# EAGLE design ArmazEthernet- Rev A1 (EAGLE 7.5.0)

## Sheet 1 of 3
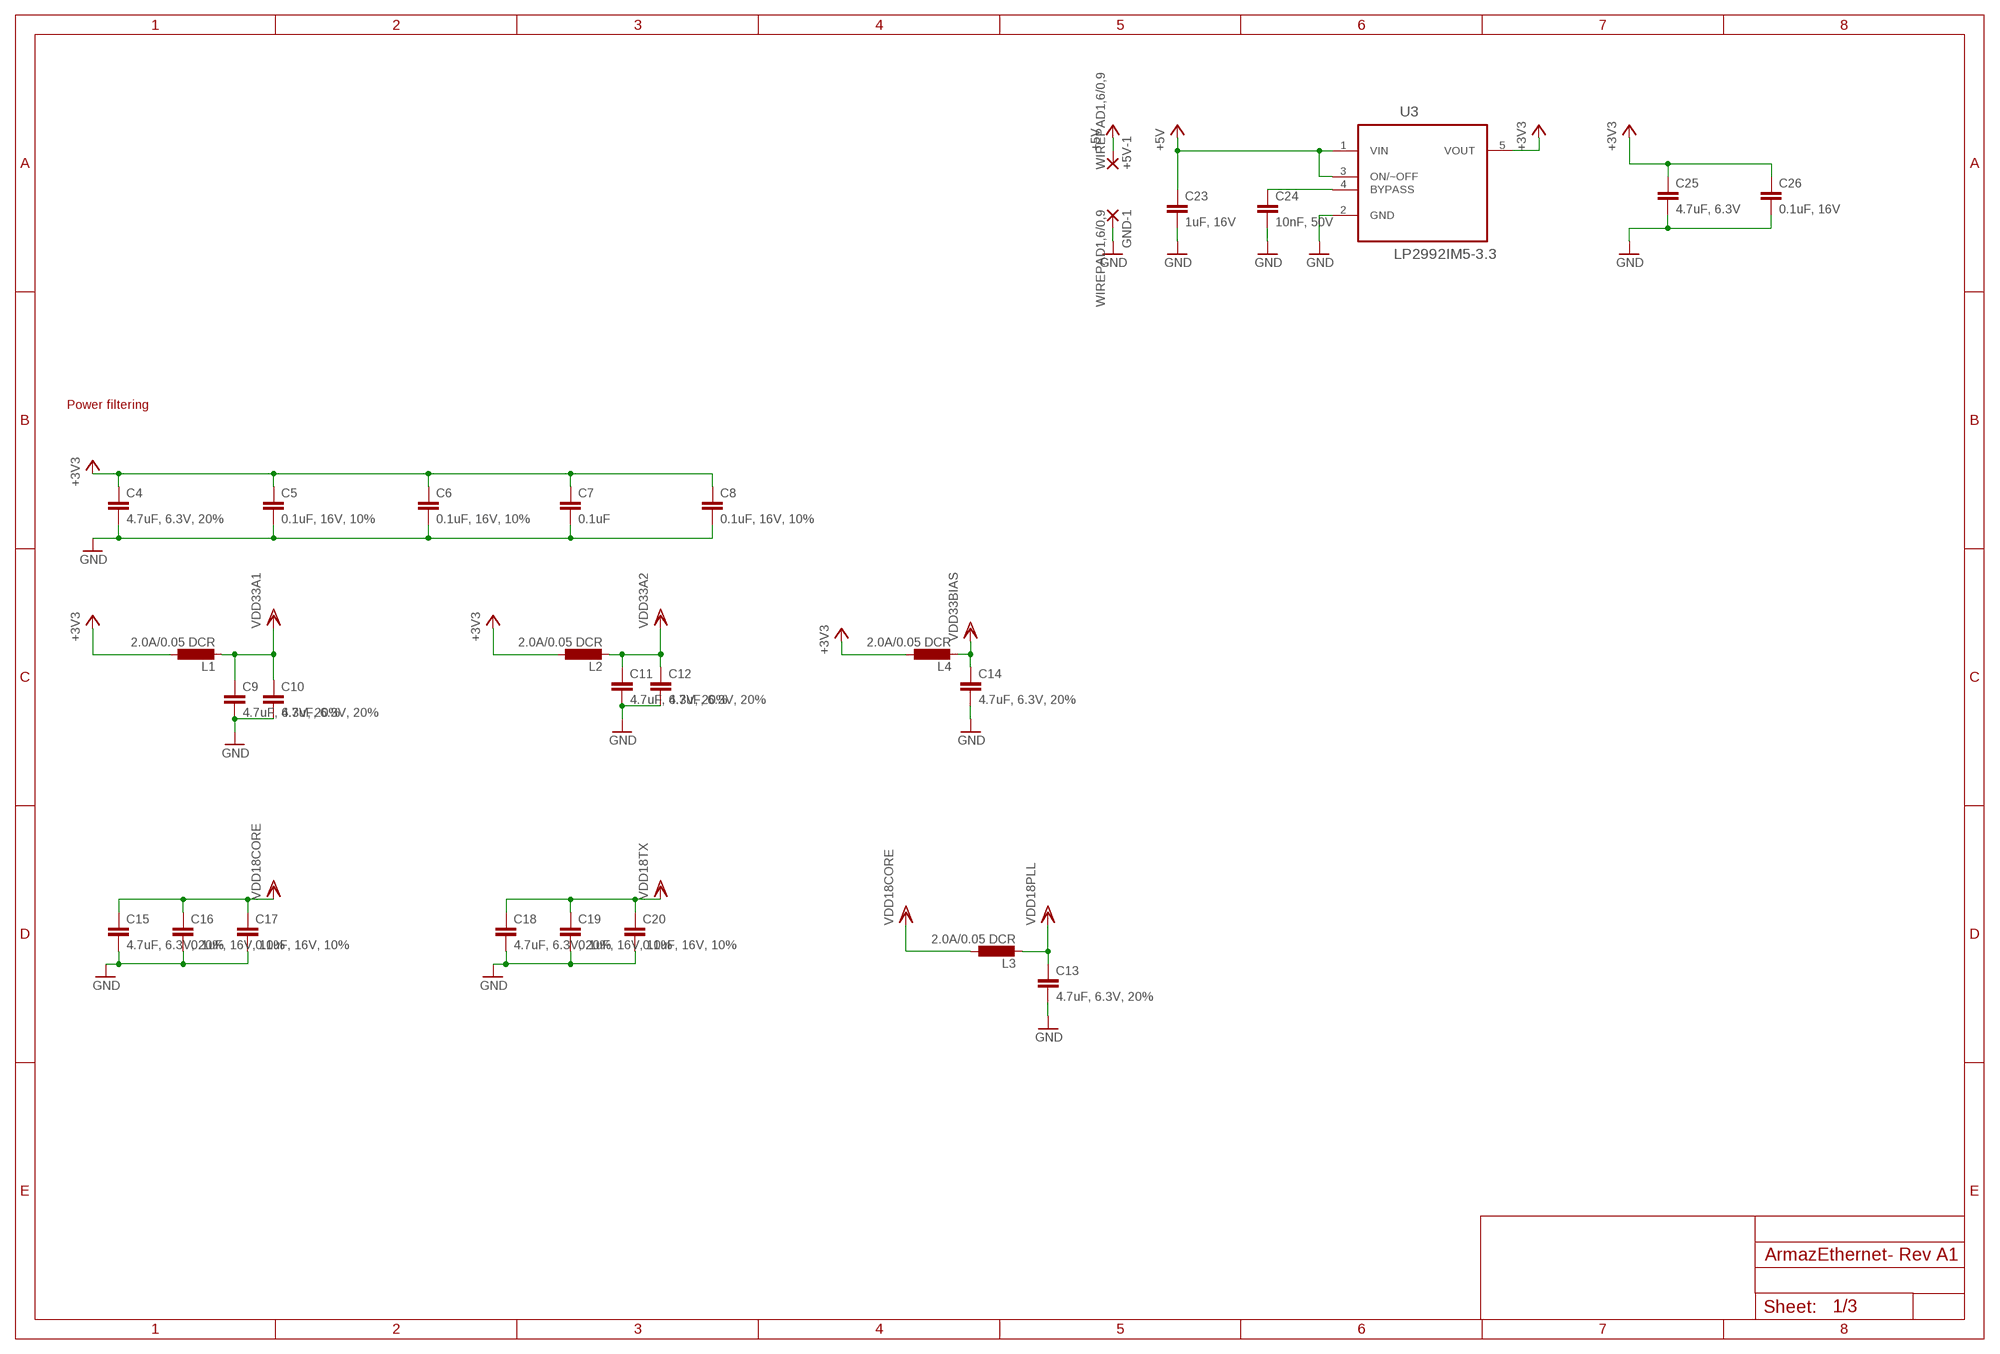
[diagram p0: schematic, sheet 1]

### Parts
+5V-1  WIREPAD1,6/0,9  [1,6/0,9]
C4  4.7uF, 6.3V, 20%  C-EUC0603  [C0603]
C5  0.1uF, 16V, 10%  C-EUC0603  [C0603]
C6  0.1uF, 16V, 10%  C-EUC0603  [C0603]
C7  0.1uF  C-EUC0603  [C0603]
C8  0.1uF, 16V, 10%  C-EUC0603  [C0603]
C9  4.7uF, 6.3V, 20%  C-EUC0603  [C0603]
C10  4.7uF, 6.3V, 20%  C-EUC0603  [C0603]
C11  4.7uF, 6.3V, 20%  C-EUC0603  [C0603]
C12  4.7uF, 6.3V, 20%  C-EUC0603  [C0603]
C13  4.7uF, 6.3V, 20%  C-EUC0603  [C0603]
C14  4.7uF, 6.3V, 20%  C-EUC0603  [C0603]
C15  4.7uF, 6.3V, 20%  C-EUC0603  [C0603]
C16  0.1uF, 16V, 10%  C-EUC0603  [C0603]
C17  0.1uF, 16V, 10%  C-EUC0603  [C0603]
C18  4.7uF, 6.3V, 20%  C-EUC0603  [C0603]
C19  0.1uF, 16V, 10%  C-EUC0603  [C0603]
C20  0.1uF, 16V, 10%  C-EUC0603  [C0603]
C23  1uF, 16V  C-EUC0603  [C0603]
C24  10nF, 50V  C-EUC0603  [C0603]
C25  4.7uF, 6.3V  C-EUC0603  [C0603]
C26  0.1uF, 16V  C-EUC0603  [C0603]
GND-1  WIREPAD1,6/0,9  [1,6/0,9]
L1  2.0A/0.05 DCR  L-EUL4532C  [L4532M]
L2  2.0A/0.05 DCR  L-EUL4532C  [L4532M]
L3  2.0A/0.05 DCR  L-EUL4532C  [L4532M]
L4  2.0A/0.05 DCR  L-EUL4532C  [L4532M]
U3  LP2992IM5-3.3  [SOT95P284X122-5N]

### Nets
+3V3 [supply2]: C4.1 C5.1 C6.1 C7.1 C8.1 C25.1 C26.1 L1.1 L2.1 L4.1 U3.5(VOUT) ; also sheet 2,3
+5V [supply]: +5V-1.1(P) C23.1 U3.1(VIN) U3.3(ON/~OFF)
GND [supply]: C4.2 C5.2 C6.2 C7.2 C8.2 C9.2 C10.2 C11.2 C12.2 C13.2 C14.2 C15.2 C16.2 C17.2 C18.2 C19.2 C20.2 C23.2 C24.2 C25.2 C26.2 GND-1.1(P) U3.2(GND) ; also sheet 2,3
N$19: C24.1 U3.4(BYPASS)
VDD18CORE [supply2]: C15.1 C16.1 C17.1 L3.1 ; also sheet 2
VDD18PLL: C13.1 L3.2 ; also sheet 2
VDD18TX [supply2]: C18.1 C19.1 C20.1 ; also sheet 2
VDD33A1 [supply2]: C9.1 C10.1 L1.2 ; also sheet 2
VDD33A2 [supply2]: C11.1 C12.1 L2.2 ; also sheet 2
VDD33BIAS [supply2]: C14.1 L4.2 ; also sheet 2

### Notes on the sheet
- Power filtering

## Sheet 2 of 3
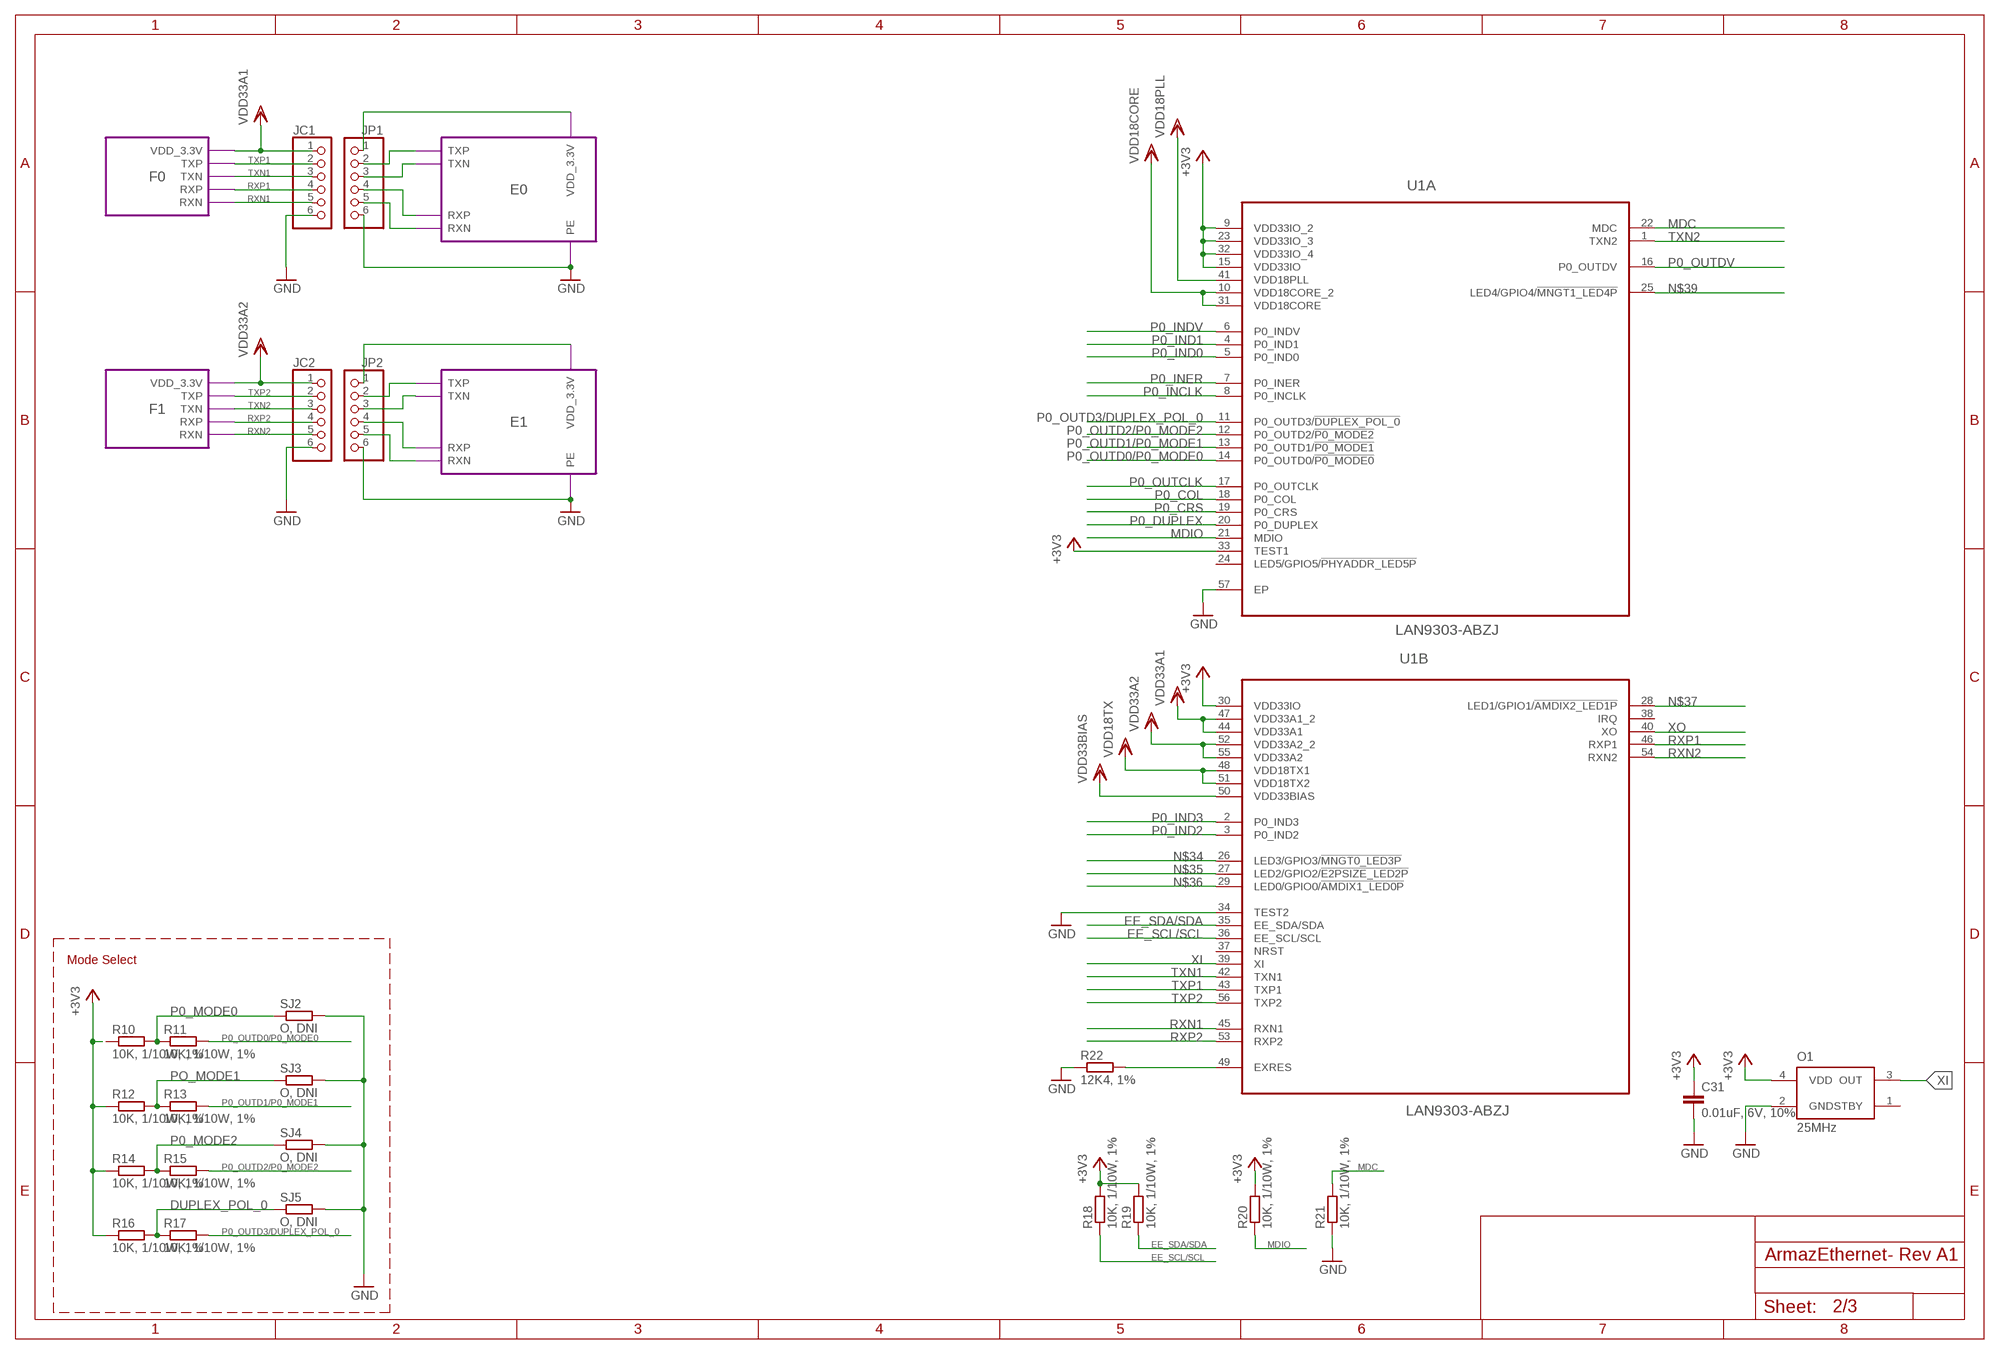
[diagram p1: schematic, sheet 2]

### Parts
C31  0.01uF, 6V, 10%  C-EUC0603  [C0603]
JC1  PINHD-1X6  [1X06]
JC2  PINHD-1X6  [1X06]
JP1  PINHD-1X6  [1X06]
JP2  PINHD-1X6  [1X06]
O1  25MHz  ADSM1-25.0000MHZ-LC-T  [ADSM]
R10  10K, 1/10W, 1%  R-EU_R0603  [R0603]
R11  10K, 1/10W, 1%  R-EU_R0603  [R0603]
R12  10K, 1/10W, 1%  R-EU_R0603  [R0603]
R13  10K, 1/10W, 1%  R-EU_R0603  [R0603]
R14  10K, 1/10W, 1%  R-EU_R0603  [R0603]
R15  10K, 1/10W, 1%  R-EU_R0603  [R0603]
R16  10K, 1/10W, 1%  R-EU_R0603  [R0603]
R17  10K, 1/10W, 1%  R-EU_R0603  [R0603]
R18  10K, 1/10W, 1%  R-EU_R0603  [R0603]
R19  10K, 1/10W, 1%  R-EU_R0603  [R0603]
R20  10K, 1/10W, 1%  R-EU_R0603  [R0603]
R21  10K, 1/10W, 1%  R-EU_R0603  [R0603]
R22  12K4, 1%  R-EU_R0603  [R0603]
SJ2  O, DNI  R-EU_R0603  [R0603]
SJ3  O, DNI  R-EU_R0603  [R0603]
SJ4  O, DNI  R-EU_R0603  [R0603]
SJ5  O, DNI  R-EU_R0603  [R0603]
U1  LAN9303-ABZJ  [QFN50P800X800X100-57N]

### Module instances
E0 = ETHERCON
E1 = ETHERCON
F0 = FILTER
F1 = FILTER

### Nets
+3V3 [supply2]: C31.1 O1.4(VDD) R10.1 R12.1 R14.1 R16.1 R18.2 R19.2 R20.2 U1.9(A:VDD33IO_2) U1.15(A:VDD33IO) U1.23(A:VDD33IO_3) U1.30(B:VDD33IO) U1.32(A:VDD33IO_4) U1.33(A:TEST1) ; also sheet 1,3
DUPLEX_POL_0: R16.2 R17.1 SJ5.1
EE_SCL/SCL: R18.1 U1.36(B:EE_SCL/SCL)
EE_SDA/SDA: R19.1 U1.35(B:EE_SDA/SDA)
GND [supply]: C31.2 JC1.6 JC2.6 JP1.6 JP2.6 O1.2(GND) R21.1 R22.1 SJ2.2 SJ3.2 SJ4.2 SJ5.2 U1.34(B:TEST2) U1.57(A:EP) ; port E0.PE E1.PE ; also sheet 1,3
MDC: R21.2 U1.22(A:MDC) ; also sheet 3
MDIO: R20.1 U1.21(A:MDIO) ; also sheet 3
N$21: R22.2 U1.49(B:EXRES)
N$22: JP1.2 ; port E0.TXP
N$23: JP1.3 ; port E0.TXN
N$24: JP1.4 ; port E0.RXP
N$25: JP1.5 ; port E0.RXN
N$29 [supply2]: JP2.1 ; port E1.VDD_3.3V
N$34: U1.26(B:LED3/GPIO3/!MNGT0_LED3P)
N$35: U1.27(B:LED2/GPIO2/!E2PSIZE_LED2P)
N$36: U1.29(B:LED0/GPIO0/!AMDIX1_LED0P)
N$37: U1.28(B:LED1/GPIO1/!AMDIX2_LED1P)
N$38 [supply2]: JP1.1 ; port E0.VDD_3.3V
N$39: U1.25(A:LED4/GPIO4/!MNGT1_LED4P)
N$300: JP2.2 ; port E1.TXP
N$301: JP2.3 ; port E1.TXN
N$302: JP2.4 ; port E1.RXP
N$303: JP2.5 ; port E1.RXN
P0_COL: U1.18(A:P0_COL) ; also sheet 3
P0_CRS: U1.19(A:P0_CRS) ; also sheet 3
P0_DUPLEX: U1.20(A:P0_DUPLEX)
P0_INCLK: U1.8(A:P0_INCLK) ; also sheet 3
P0_IND0: U1.5(A:P0_IND0) ; also sheet 3
P0_IND1: U1.4(A:P0_IND1) ; also sheet 3
P0_IND2: U1.3(B:P0_IND2) ; also sheet 3
P0_IND3: U1.2(B:P0_IND3) ; also sheet 3
P0_INDV: U1.6(A:P0_INDV) ; also sheet 3
P0_INER: U1.7(A:P0_INER) ; also sheet 3
P0_MODE0: R10.2 R11.1 SJ2.1
P0_MODE2: R14.2 R15.1 SJ4.1
P0_OUTCLK: U1.17(A:P0_OUTCLK) ; also sheet 3
P0_OUTD0/P0_MODE0: R11.2 U1.14(A:P0_OUTD0/!P0_MODE0) ; also sheet 3
P0_OUTD1/P0_MODE1: R13.2 U1.13(A:P0_OUTD1/!P0_MODE1)
P0_OUTD2/P0_MODE2: R15.2 U1.12(A:P0_OUTD2/!P0_MODE2) ; also sheet 3
P0_OUTD3/DUPLEX_POL_0: R17.2 U1.11(A:P0_OUTD3/!DUPLEX_POL_0) ; also sheet 3
P0_OUTDV: U1.16(A:P0_OUTDV) ; also sheet 3
PO_MODE1: R12.2 R13.1 SJ3.1
RXN1: JC1.5 U1.45(B:RXN1) ; port F0.RXN
RXN2: JC2.5 U1.54(B:RXN2) ; port F1.RXN
RXP1: JC1.4 U1.46(B:RXP1) ; port F0.RXP
RXP2: JC2.4 U1.53(B:RXP2) ; port F1.RXP
TXN1: JC1.3 U1.42(B:TXN1) ; port F0.TXN
TXN2: JC2.3 U1.1(A:TXN2) ; port F1.TXN
TXP1: JC1.2 U1.43(B:TXP1) ; port F0.TXP
TXP2: JC2.2 U1.56(B:TXP2) ; port F1.TXP
VDD18CORE [supply2]: U1.10(A:VDD18CORE_2) U1.31(A:VDD18CORE) ; also sheet 1
VDD18PLL: U1.41(A:VDD18PLL) ; also sheet 1
VDD18TX [supply2]: U1.48(B:VDD18TX1) U1.51(B:VDD18TX2) ; also sheet 1
VDD33A1 [supply2]: JC1.1 U1.44(B:VDD33A1) U1.47(B:VDD33A1_2) ; port F0.VDD_3.3V ; also sheet 1
VDD33A2 [supply2]: JC2.1 U1.52(B:VDD33A2_2) U1.55(B:VDD33A2) ; port F1.VDD_3.3V ; also sheet 1
VDD33BIAS [supply2]: U1.50(B:VDD33BIAS) ; also sheet 1
XI: O1.3(OUT) U1.39(B:XI)
XO: U1.40(B:XO)
Unconnected: O1.1(STBY) U1.24(A:LED5/GPIO5/!PHYADDR_LED5P) U1.37(B:NRST) U1.38(B:IRQ)

### Notes on the sheet
- Mode Select

## Sheet 3 of 3
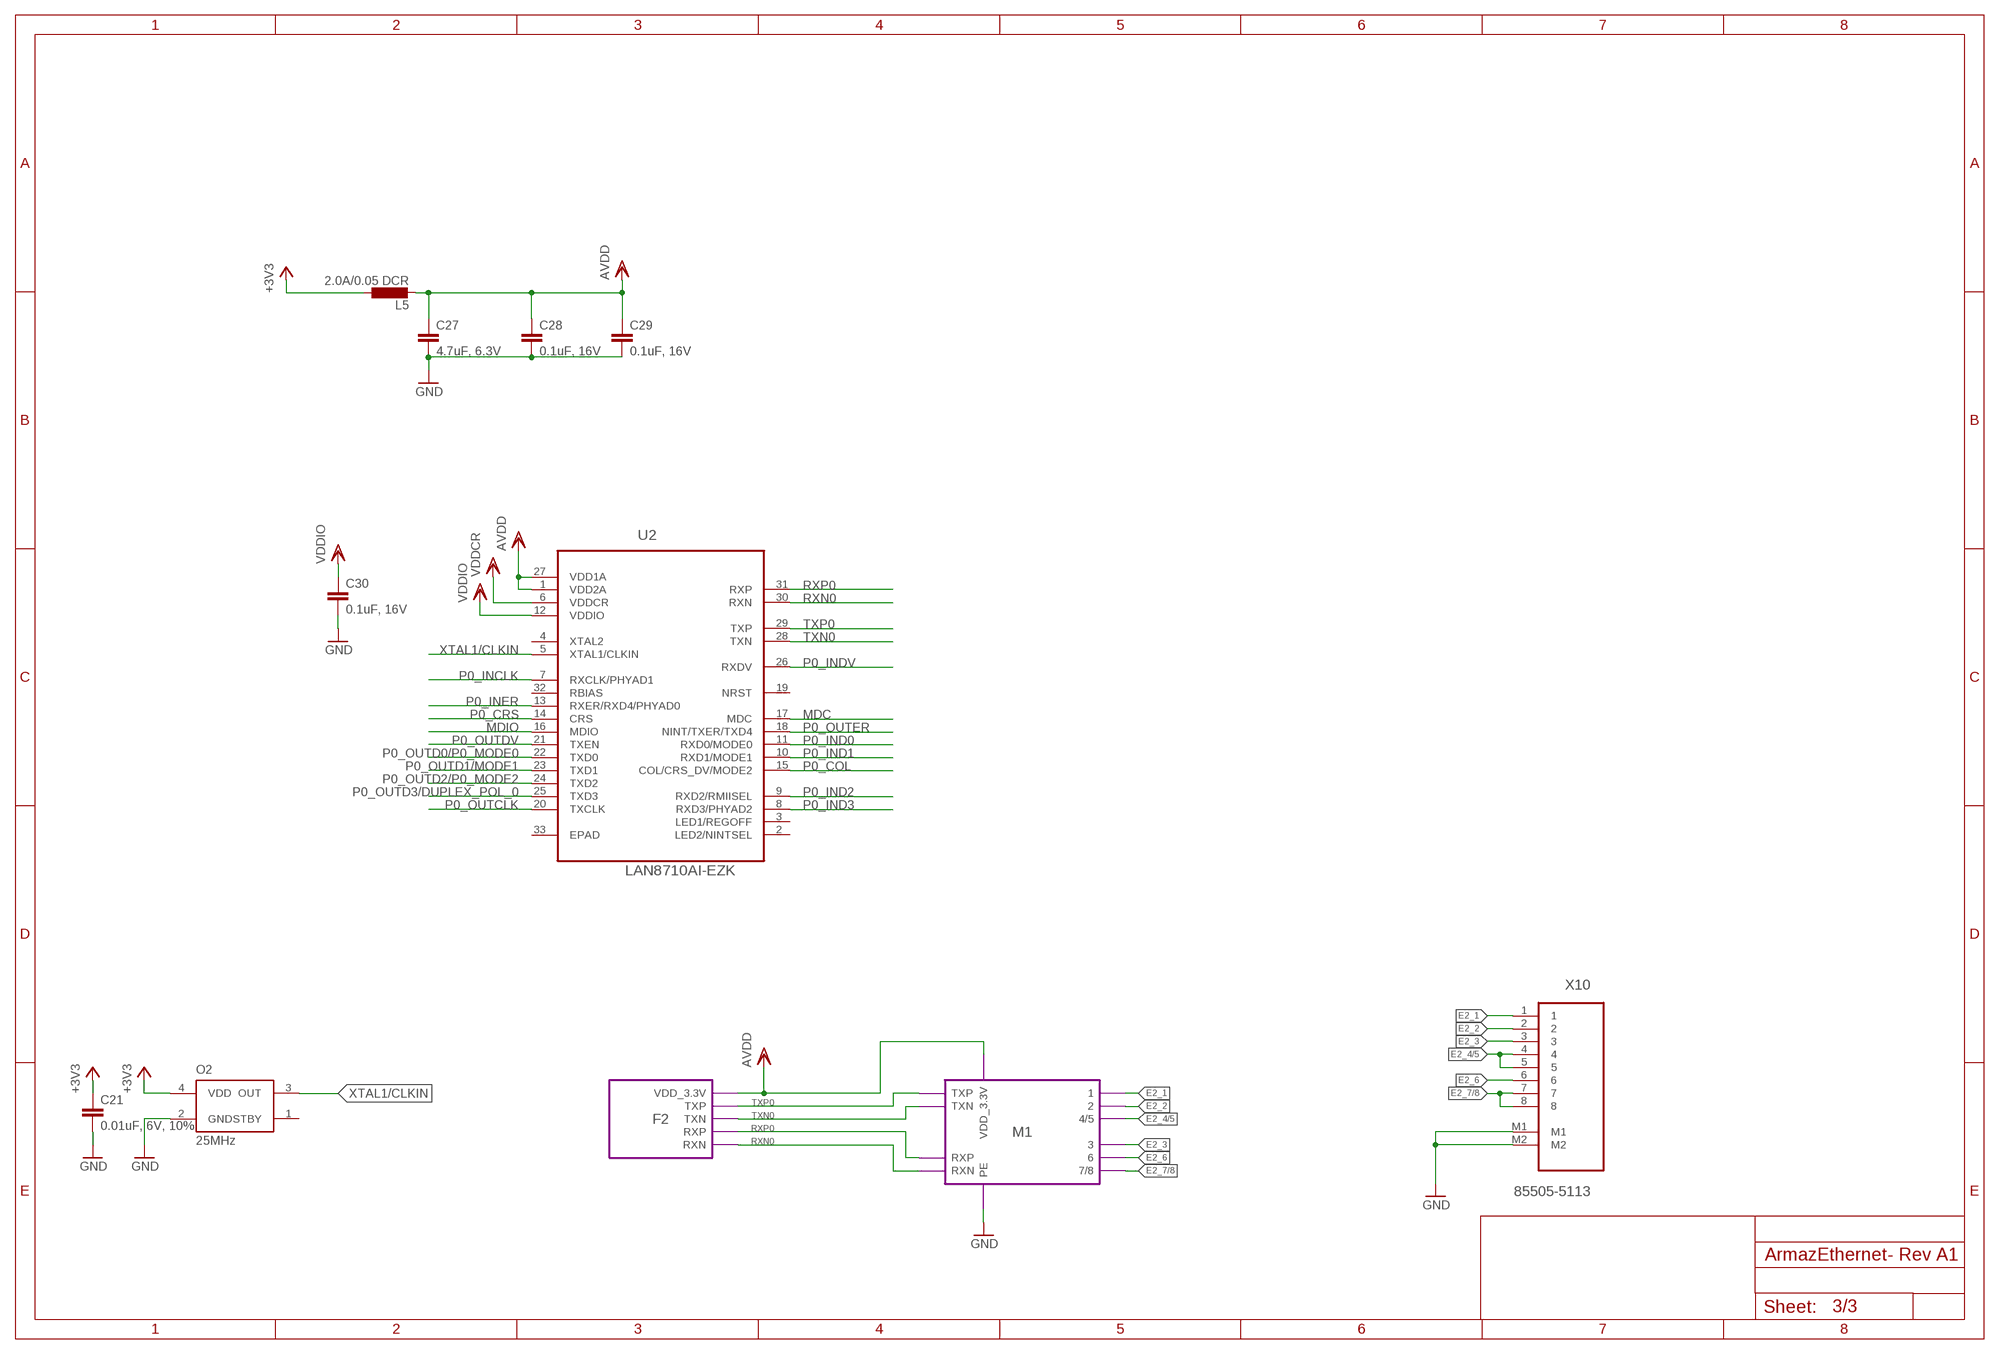
[diagram p2: schematic, sheet 3]

### Parts
C21  0.01uF, 6V, 10%  C-EUC0603  [C0603]
C27  4.7uF, 6.3V  C-EUC0603  [C0603]
C28  0.1uF, 16V  C-EUC0603  [C0603]
C29  0.1uF, 16V  C-EUC0603  [C0603]
C30  0.1uF, 16V  C-EUC0603  [C0603]
L5  2.0A/0.05 DCR  L-EUL4532C  [L4532M]
O2  25MHz  ADSM1-25.0000MHZ-LC-T  [ADSM]
U2  LAN8710AI-EZK  [QFN50P500X500X100-33N]
X10  85505-5113  [MOLEX_85505-5113]

### Module instances
M1 = MAGNETICS
F2 = FILTER

### Nets
+3V3 [supply2]: C21.1 L5.1 O2.4(VDD) ; also sheet 1,2
AVDD [supply2]: C27.1 C28.1 C29.1 L5.2 U2.1(VDD2A) U2.27(VDD1A) ; port F2.VDD_3.3V M1.VDD_3.3V
E2_1: X10.1 ; port M1.1
E2_2: X10.2 ; port M1.2
E2_3: X10.3 ; port M1.3
E2_4/5: X10.4 X10.5 ; port M1.4/5
E2_6: X10.6 ; port M1.6
E2_7/8: X10.7 X10.8 ; port M1.7/8
GND [supply]: C21.2 C27.2 C28.2 C29.2 C30.2 O2.2(GND) X10.M1 X10.M2 ; port M1.PE ; also sheet 1,2
MDC: U2.17(MDC) ; also sheet 2
MDIO: U2.16(MDIO) ; also sheet 2
P0_COL: U2.15(COL/CRS_DV/MODE2) ; also sheet 2
P0_CRS: U2.14(CRS) ; also sheet 2
P0_INCLK: U2.7(RXCLK/PHYAD1) ; also sheet 2
P0_IND0: U2.11(RXD0/MODE0) ; also sheet 2
P0_IND1: U2.10(RXD1/MODE1) ; also sheet 2
P0_IND2: U2.9(RXD2/RMIISEL) ; also sheet 2
P0_IND3: U2.8(RXD3/PHYAD2) ; also sheet 2
P0_INDV: U2.26(RXDV) ; also sheet 2
P0_INER: U2.13(RXER/RXD4/PHYAD0) ; also sheet 2
P0_OUTCLK: U2.20(TXCLK) ; also sheet 2
P0_OUTD0/P0_MODE0: U2.22(TXD0) ; also sheet 2
P0_OUTD1/MODE1: U2.23(TXD1)
P0_OUTD2/P0_MODE2: U2.24(TXD2) ; also sheet 2
P0_OUTD3/DUPLEX_POL_0: U2.25(TXD3) ; also sheet 2
P0_OUTDV: U2.21(TXEN) ; also sheet 2
P0_OUTER: U2.18(NINT/TXER/TXD4)
RXN0: U2.30(RXN) ; port F2.RXN M1.RXN
RXP0: U2.31(RXP) ; port F2.RXP M1.RXP
TXN0: U2.28(TXN) ; port F2.TXN M1.TXN
TXP0: U2.29(TXP) ; port F2.TXP M1.TXP
VDDCR: U2.6(VDDCR)
VDDIO: C30.1 U2.12(VDDIO)
XTAL1/CLKIN: O2.3(OUT) U2.5(XTAL1/CLKIN)
Unconnected: O2.1(STBY) U2.2(LED2/NINTSEL) U2.3(LED1/REGOFF) U2.4(XTAL2) U2.19(NRST) U2.32(RBIAS) U2.33(EPAD)

## Library data of the parts
+5V-1 GND-1 = wirepad:WIREPAD: Wire PAD connect wire on PCB; OC_FARNELL: unknown
C4 C9-C15 C18 C25 = rcl:C-EU: CAPACITOR, European symbol; MF: MURATA; MPN: GRM155R60J475ME47D; OC_FARNELL: 2426952
C5-C8 C16 C17 C19 C20 C26 C28-C30 = rcl:C-EU: CAPACITOR, European symbol; MF: MULTICOMP; MPN: MC0603B104K160CT; OC_FARNELL: 1759016
C21 C31 = rcl:C-EU: CAPACITOR, European symbol; MF: MULTICOMP; MPN: MC0603B103K160CT; OC_FARNELL: 1759003
C23 = rcl:C-EU: CAPACITOR, European symbol; MF: MULTICOMP; MPN: MC0603X105K160CT; OC_FARNELL: 1759407
C24 = rcl:C-EU: CAPACITOR, European symbol; MF: MULTICOMP; MPN: MC0402F103Z500CT; OC_FARNELL: 1759001
C27 = rcl:C-EU: CAPACITOR, European symbol; MF: MULTICOMP; MPN: MC0603X475K6R3CT; OC_FARNELL: 2320811
JC1 JC2 JP1 JP2 = pinhead:PINHD-1X6: PIN HEADER; MF: MULTICOMP; MPN: MC34751; OC_FARNELL: 1593430
L1-L5 = rcl:L-EU: INDUCTOR, European symbol; MF: MURATA; MPN: LQH43PN2R2M26L; OC_FARNELL: 2219282
O1 O2 = crystal:ADSM?; MF: ABRACON; MPN: ASDM1-25.000MHZ-LC-T; OC_FARNELL: 2467877
R10-R21 = rcl:R-EU_: RESISTOR, European symbol; MF: MULTICOMP; MPN: MCMR04X1002FTL; OC_FARNELL: 2072517
R22 = rcl:R-EU_: RESISTOR, European symbol; MF: MULTICOMP; MPN: MC00625W0402112K4; OC_FARNELL: 1803145
SJ2-SJ5 = rcl:R-EU_: RESISTOR, European symbol; OC_FARNELL: unknown
U1 = Microchip_By_element14_Batch_1:LAN9303-ABZJ: Ethernet Switch,56VQFN; MF: MICROCHIP; MPN: LAN9303-ABZJ; OC_FARNELL: 2292583; OC_NEWARK: 66W1986; PACKAGE: 56VQFN; SUPPLIER: MICROCHIP
U2 = Microchip_By_element14_Batch_1:LAN8710AI-EZK: IC, MII/RMII 10/100 ENET TRX, 32VQFN; MF: MICROCHIP; MPN: LAN8710AI-EZK; OC_FARNELL: 2292576; OC_NEWARK: 66W1983; PACKAGE: 32VQFN; SUPPLIER: Microchip
U3 = NSC_By_element14_Batch_1.1:LP2992IM5-3.3: Low-Dropout Regulator; MF: TEXAS INSTRUMENTS; MPN: LP2992IM5-3.3/NOPB; OC_FARNELL: 1469141; OC_NEWARK: 41K7301; PACKAGE: SOT23-5; SUPPLIER: National Semiconductor
X10 = Molex-8550x-xxxx:85505-5113: CONNECTOR, RJ45, JACK, 8P8C, 1PORT, CAT5E; MF: MOLEX; MPN: 85505-5113; OC_FARNELL: 1560163; OC_NEWARK: 96M8715; PACKAGE: RJ45, JACK, 8P8C; SUPPLIER: Molex

## Module MAGNETICS
Ports: TXP(io) TXN(io) RXP(io) RXN(io) PE(pwr) 1(io) 2(io) 4/5(io) 3(io) 6(io) 7/8(io) VDD_3.3V(pwr)
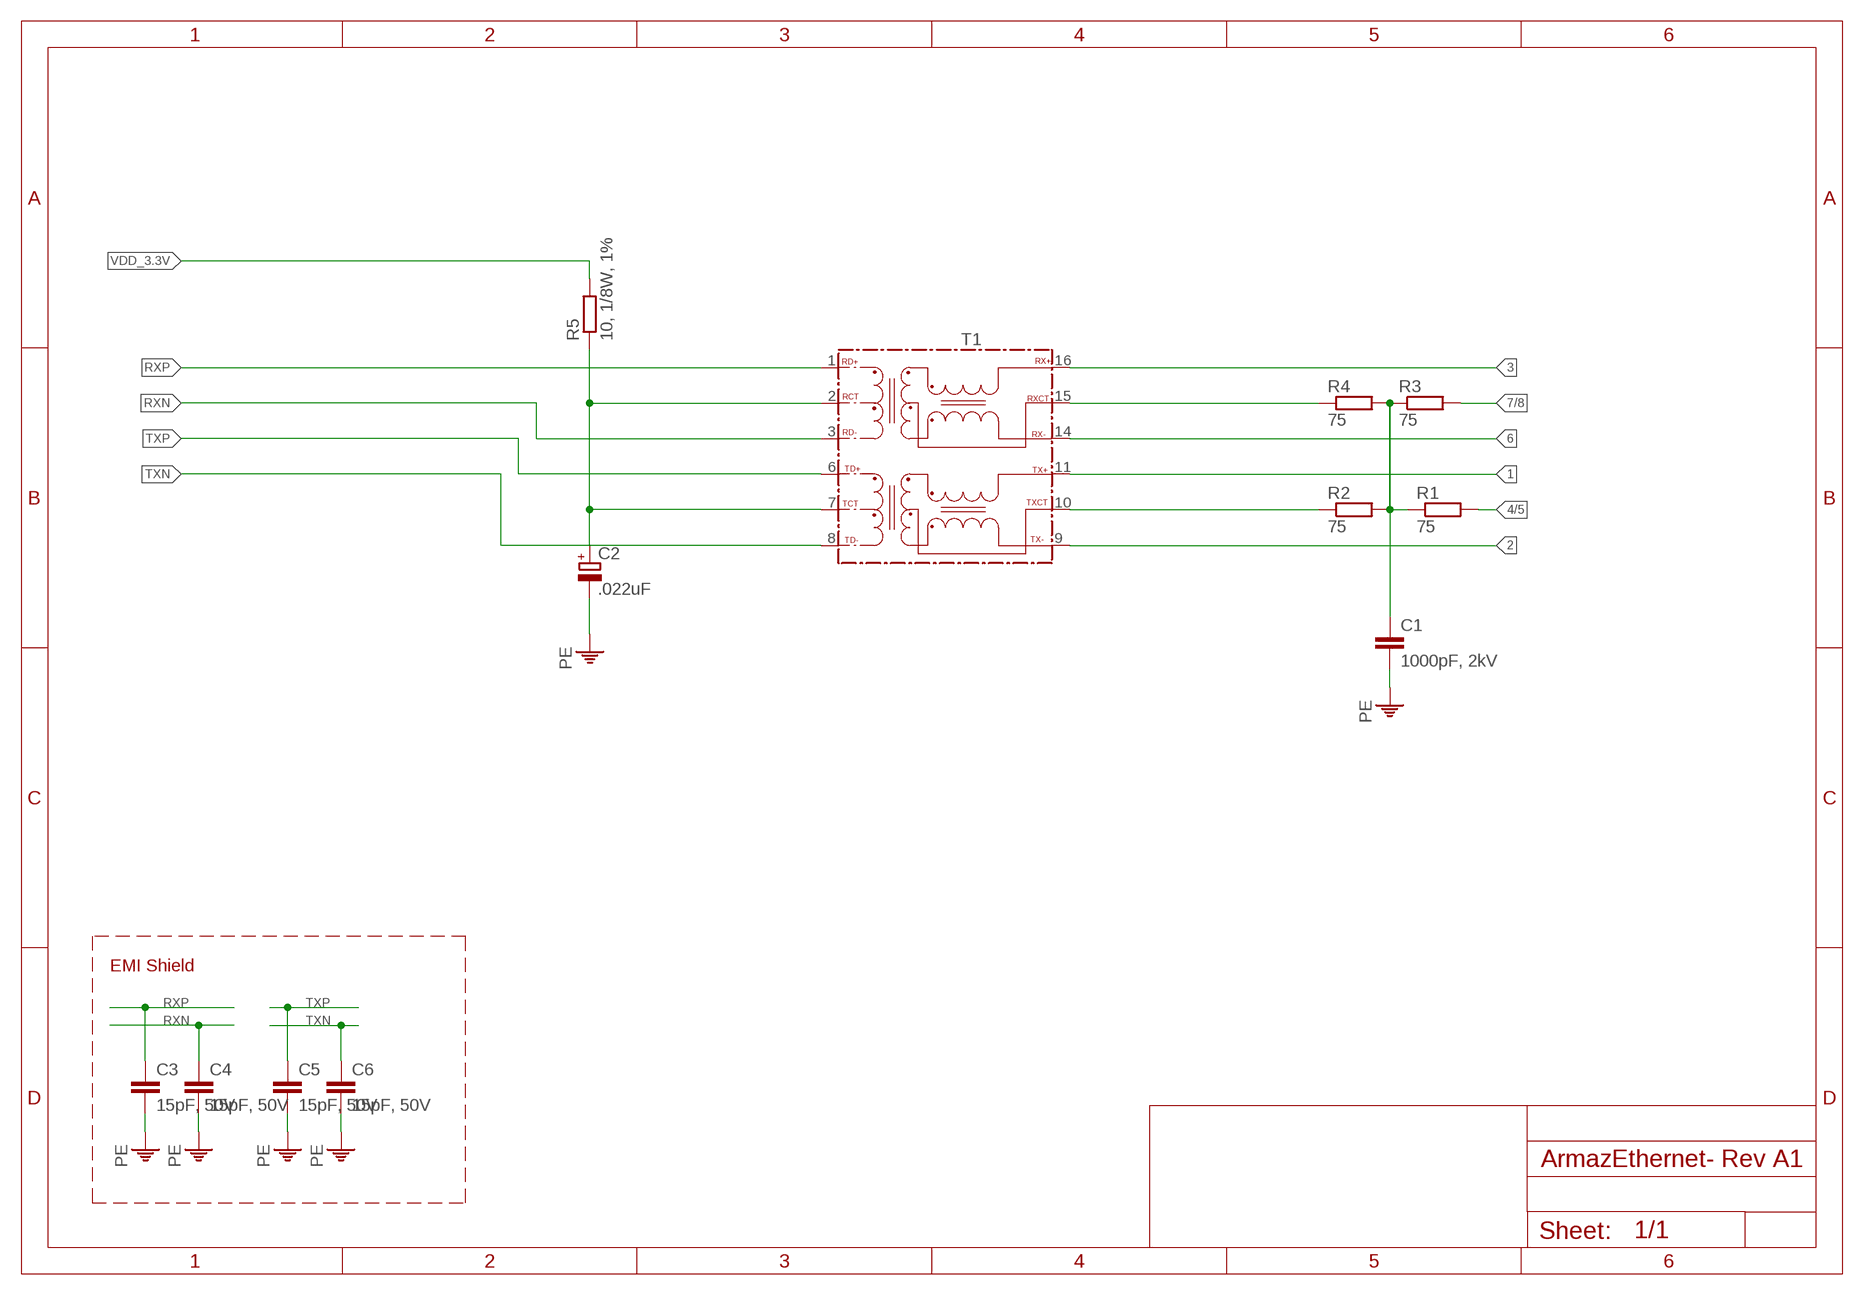
[diagram p3: schematic, module MAGNETICS, sheet 1]

### Parts
C1  1000pF, 2kV  C-EUC1206  [C1206]
C2  .022uF  CPOL-EUSMCB  [SMC_B]
C3  15pF, 50V  C-EUC0603  [C0603]
C4  15pF, 50V  C-EUC0603  [C0603]
C5  15pF, 50V  C-EUC0603  [C0603]
C6  15pF, 50V  C-EUC0603  [C0603]
R1  75  R-EU_R0603  [R0603]
R2  75  R-EU_R0603  [R0603]
R3  75  R-EU_R0603  [R0603]
R4  75  R-EU_R0603  [R0603]
R5  10, 1/8W, 1%  R-EU_R0603  [R0603]
T1  WE-LAN-10/100-BASE-T,749010012  [749010012]

### Nets
1: T1.11(TX+)
2: T1.9(TX-)
3: T1.16(RX+)
4/5: R1.2
6: T1.14(RX-)
7/8: R3.2
N$1: C2.+ R5.1 T1.2(RCT) T1.7(TCT)
N$2: R2.1 T1.10(TXCT)
N$3: R4.1 T1.15(RXCT)
N$8: C1.1 R1.1 R2.2 R3.1 R4.2
PE: C1.2 C2.- C3.2 C4.2 C5.2 C6.2
RXN: C4.1 T1.3(RD-)
RXP: C3.1 T1.1(RD+)
TXN: C6.1 T1.8(TD-)
TXP: C5.1 T1.6(TD+)
VDD_3.3V: R5.2

### Notes on the sheet
- EMI Shield

### Library data of the parts
C1 = rcl:C-EU: CAPACITOR, European symbol; MF: MULTICOMP; MPN: MC1206B102K202CT; OC_FARNELL: 1855909
C2 = rcl:CPOL-EU: POLARIZED CAPACITOR, European symbol; MF: MULTICOMP; MPN: MC0805B223K500CT; OC_FARNELL: 1759252
C3-C6 = rcl:C-EU: CAPACITOR, European symbol; MF: MULTICOMP; MPN: MC0402N150J500CT; OC_FARNELL: 1758945
R1-R4 = rcl:R-EU_: RESISTOR, European symbol; MF: MULTICOMP; MPN: MC00625W0402175R; OC_FARNELL: 1358012
R5 = rcl:R-EU_: RESISTOR, European symbol; MF: MULTICOMP; MPN: MCHP03W8F100JT5E; OC_FARNELL: 1576250
T1 = WE-LAN-10_100-BASE-T_749010012:WE-LAN-10/100-BASE-T,749010012: LAN-Transformer WE-LAN 10/100 Base T - Compliant with IEEE 802.3 standards - SMD -- Ethernet -- Power over Ethernet -- 1 Gigabit Ethernet -- Compliant with most IC's for ethernet applications like Intel, AMD, Globespan and Realtek -- Hub, Router, Switch; MF: WURTH ELEKTRONIK; MPN: 749010012; OC_FARNELL: 1636345; OC_NEWARK: unknown; PACKAGE: 10/100/Base-T; SUPPLIER: Wuerth Elektronik

## Module ETHERCON
Ports: PE(pwr) VDD_3.3V(pwr) TXP(io) TXN(io) RXP(io) RXN(io)
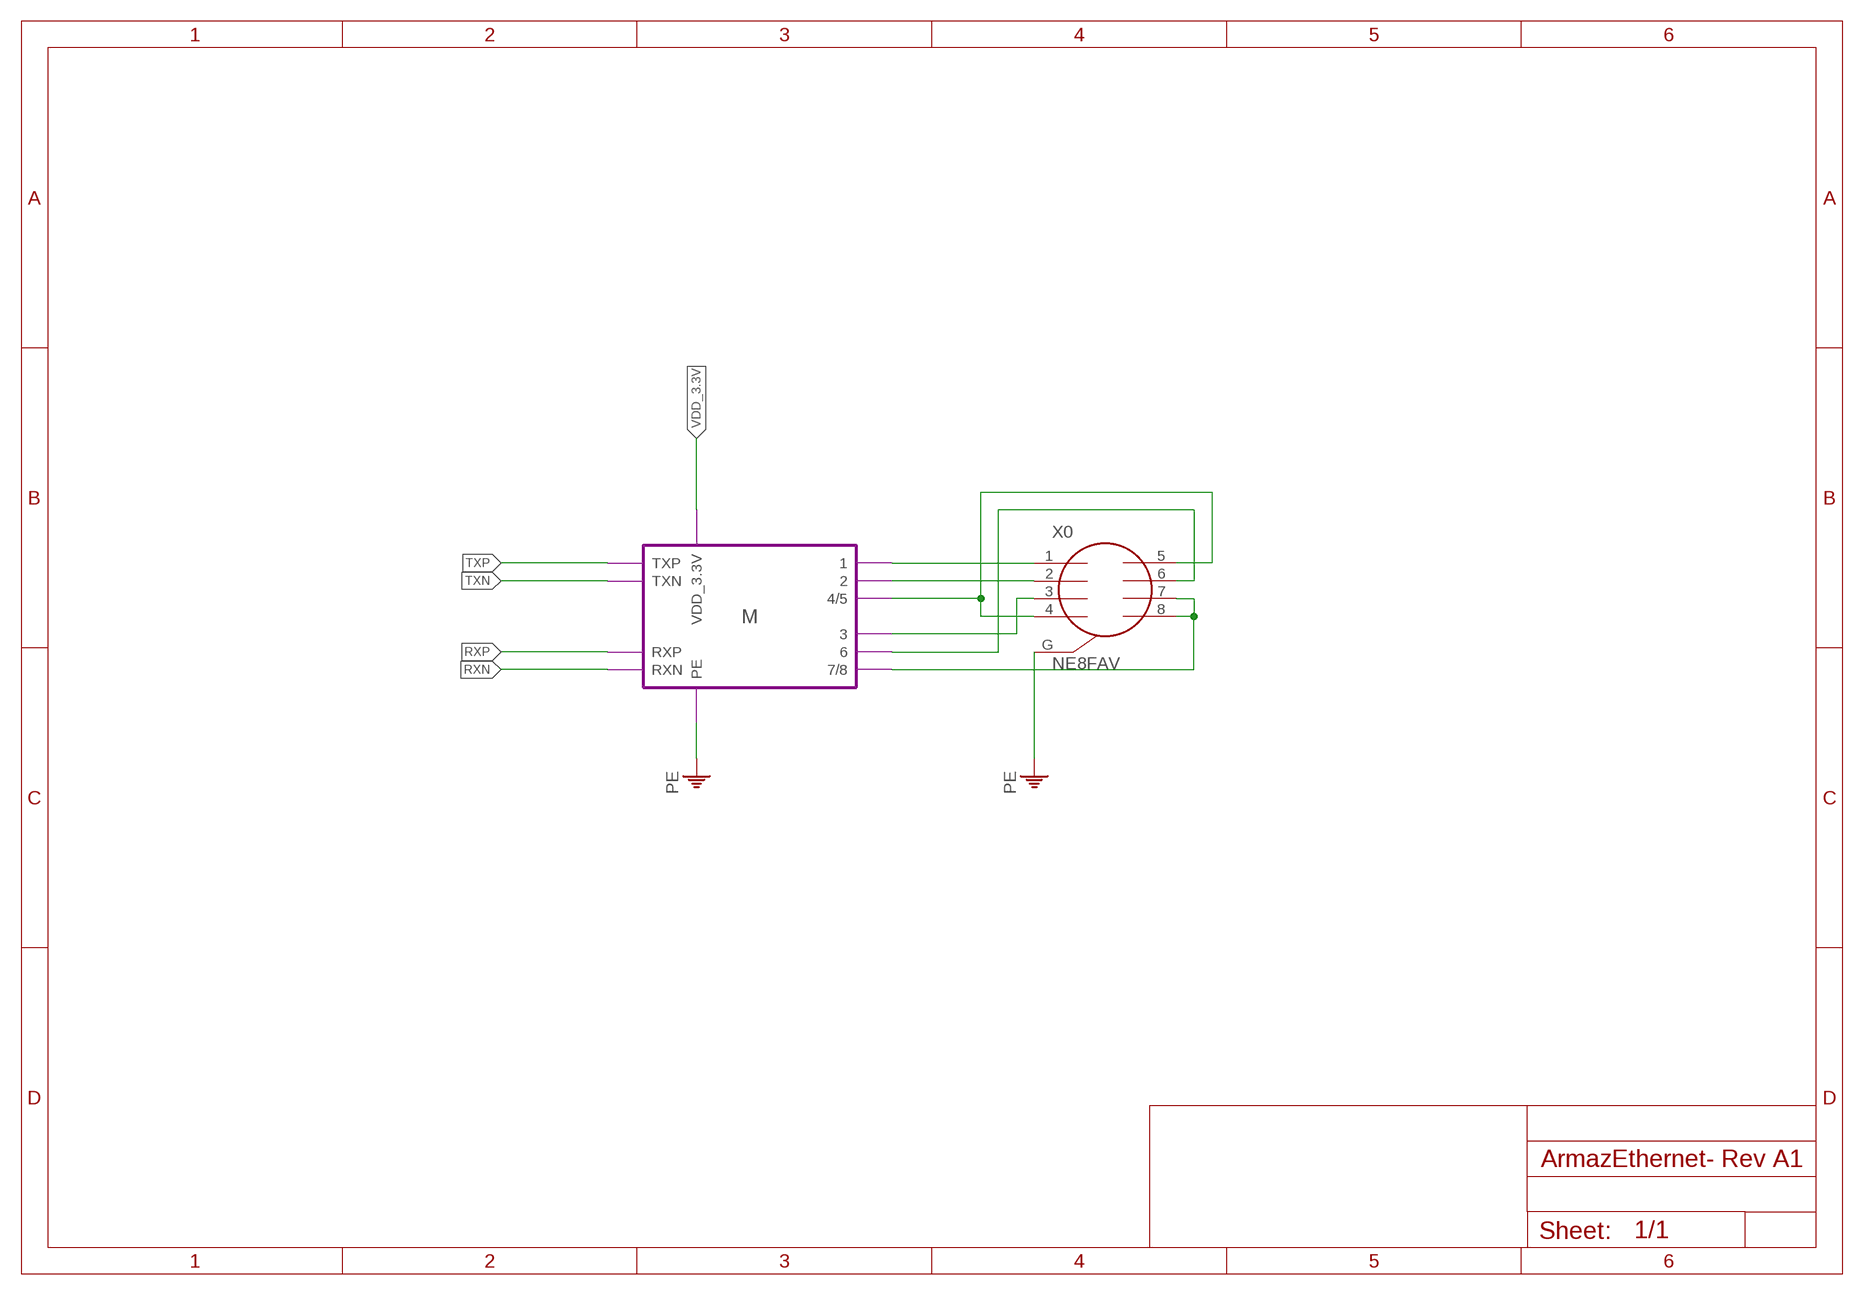
[diagram p4: schematic, module ETHERCON, sheet 1]

### Parts
X0  NE8FAV  [NE8FAV]

### Module instances
M = MAGNETICS

### Nets
N$1: X0.1 ; port M.1
N$2: X0.2 ; port M.2
N$3: X0.3 ; port M.3
N$4: X0.6 ; port M.6
N$5: X0.4 X0.5 ; port M.4/5
N$6: X0.7 X0.8 ; port M.7/8
PE: X0.G ; port M.PE
RXN: port M.RXN
RXP: port M.RXP
TXN: port M.TXN
TXP: port M.TXP
VDD_3.3V: port M.VDD_3.3V

### Library data of the parts
X0 = con-neutrik_ag:NE8; MF: NEUTRIK; MPN: NE8FAV; OC_FARNELL: 1202031

## Module FILTER
Ports: TXP(io) TXN(io) RXP(io) RXN(io) VDD_3.3V(io)
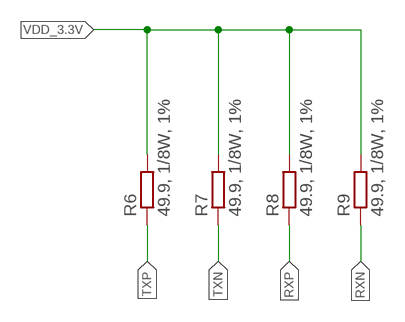
[diagram p5: schematic, module FILTER, sheet 1]

### Parts
R6  49.9, 1/8W, 1%  R-EU_R0603  [R0603]
R7  49.9, 1/8W, 1%  R-EU_R0603  [R0603]
R8  49.9, 1/8W, 1%  R-EU_R0603  [R0603]
R9  49.9, 1/8W, 1%  R-EU_R0603  [R0603]

### Nets
RXN: R9.1
RXP: R8.1
TXN: R7.1
TXP: R6.1
VDD_3.3V: R6.2 R7.2 R8.2 R9.2

### Library data of the parts
R6-R9 = rcl:R-EU_: RESISTOR, European symbol; MF: MULTICOMP; MPN: MCMR04X49R9FTL; OC_FARNELL: 2073090

## Net classes
0 default: width 0.152 mm, drill 0.2 mm, clearance 0.205 mm
1 supply: width 0.406 mm, drill 0.35 mm, clearance 0.205 mm to class 0, clearance 0.205 mm
2 supply2: width 0.203 mm, drill 0.25 mm, clearance 0.205 mm to class 0, clearance 0.205 mm to class 1, clearance 0.205 mm

## Board
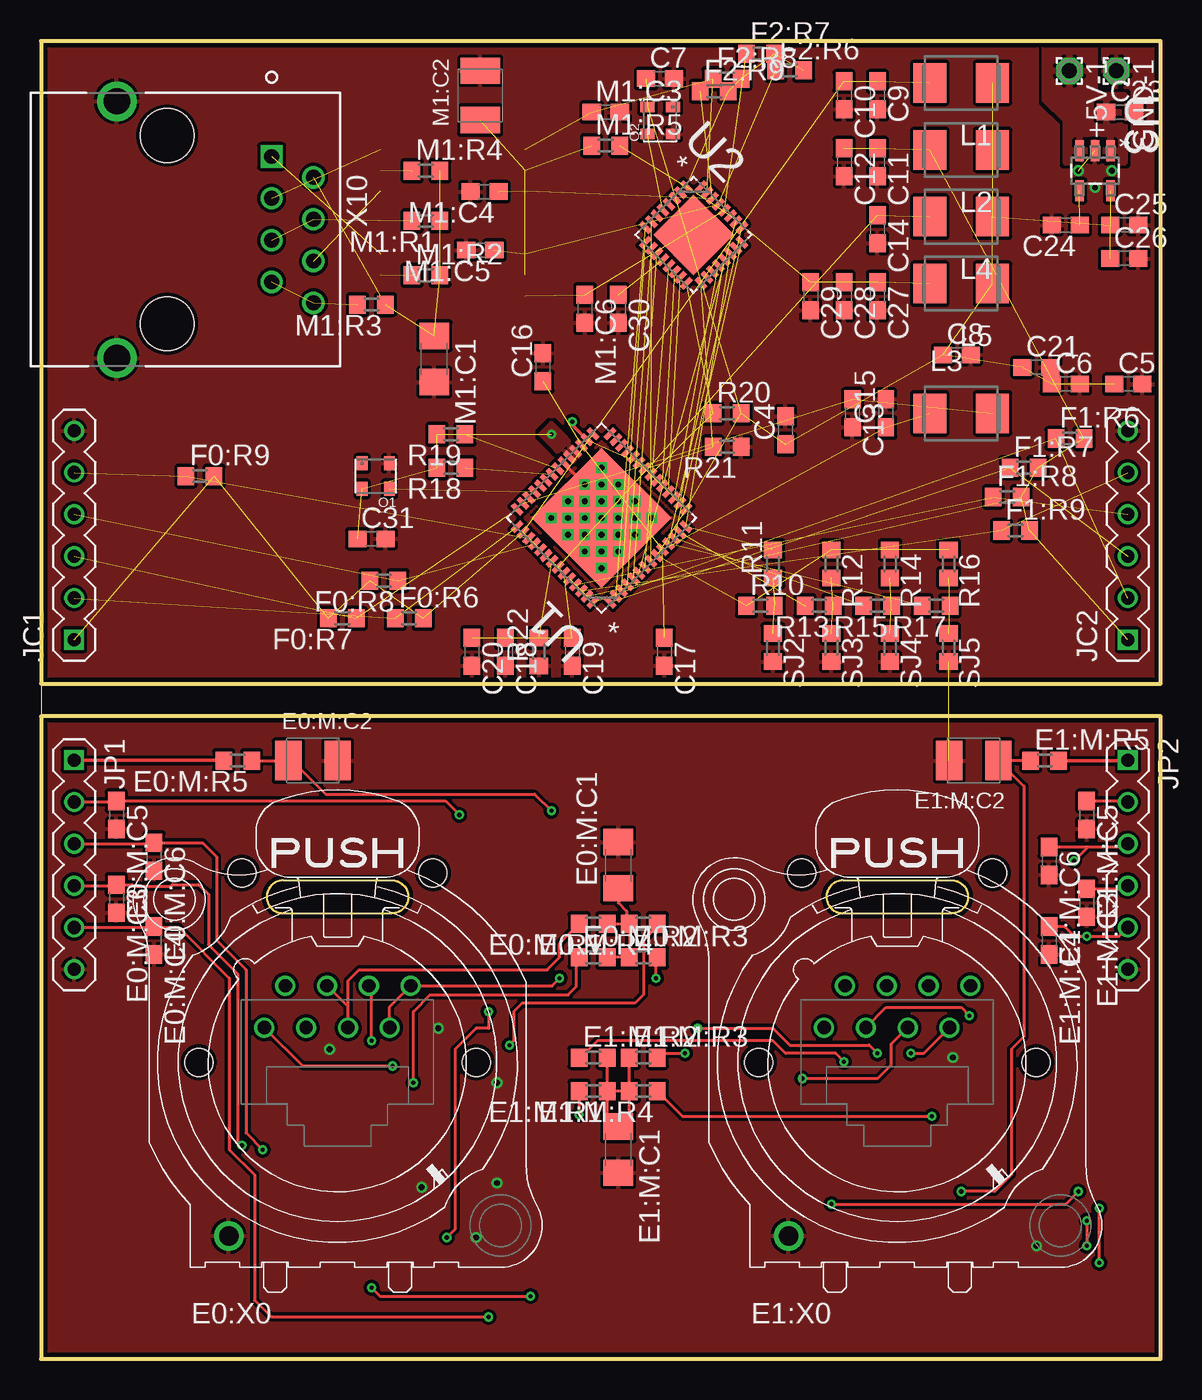
[diagram p6: board, top side]
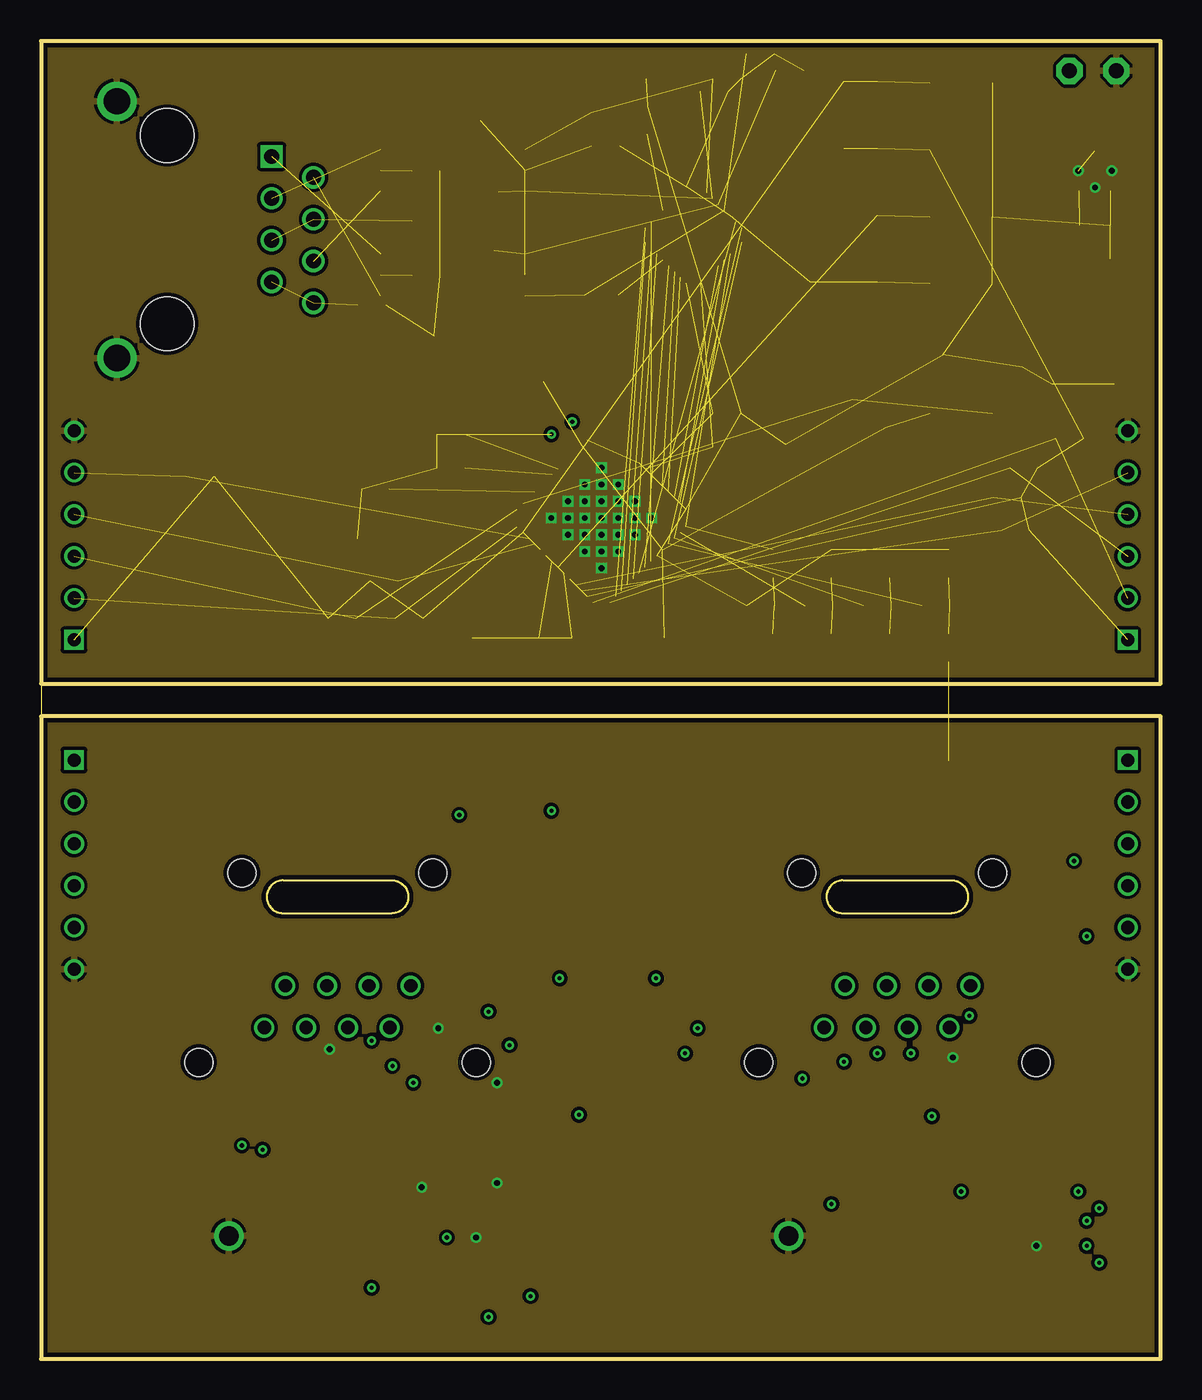
[diagram p7: board, inner layer Route2]
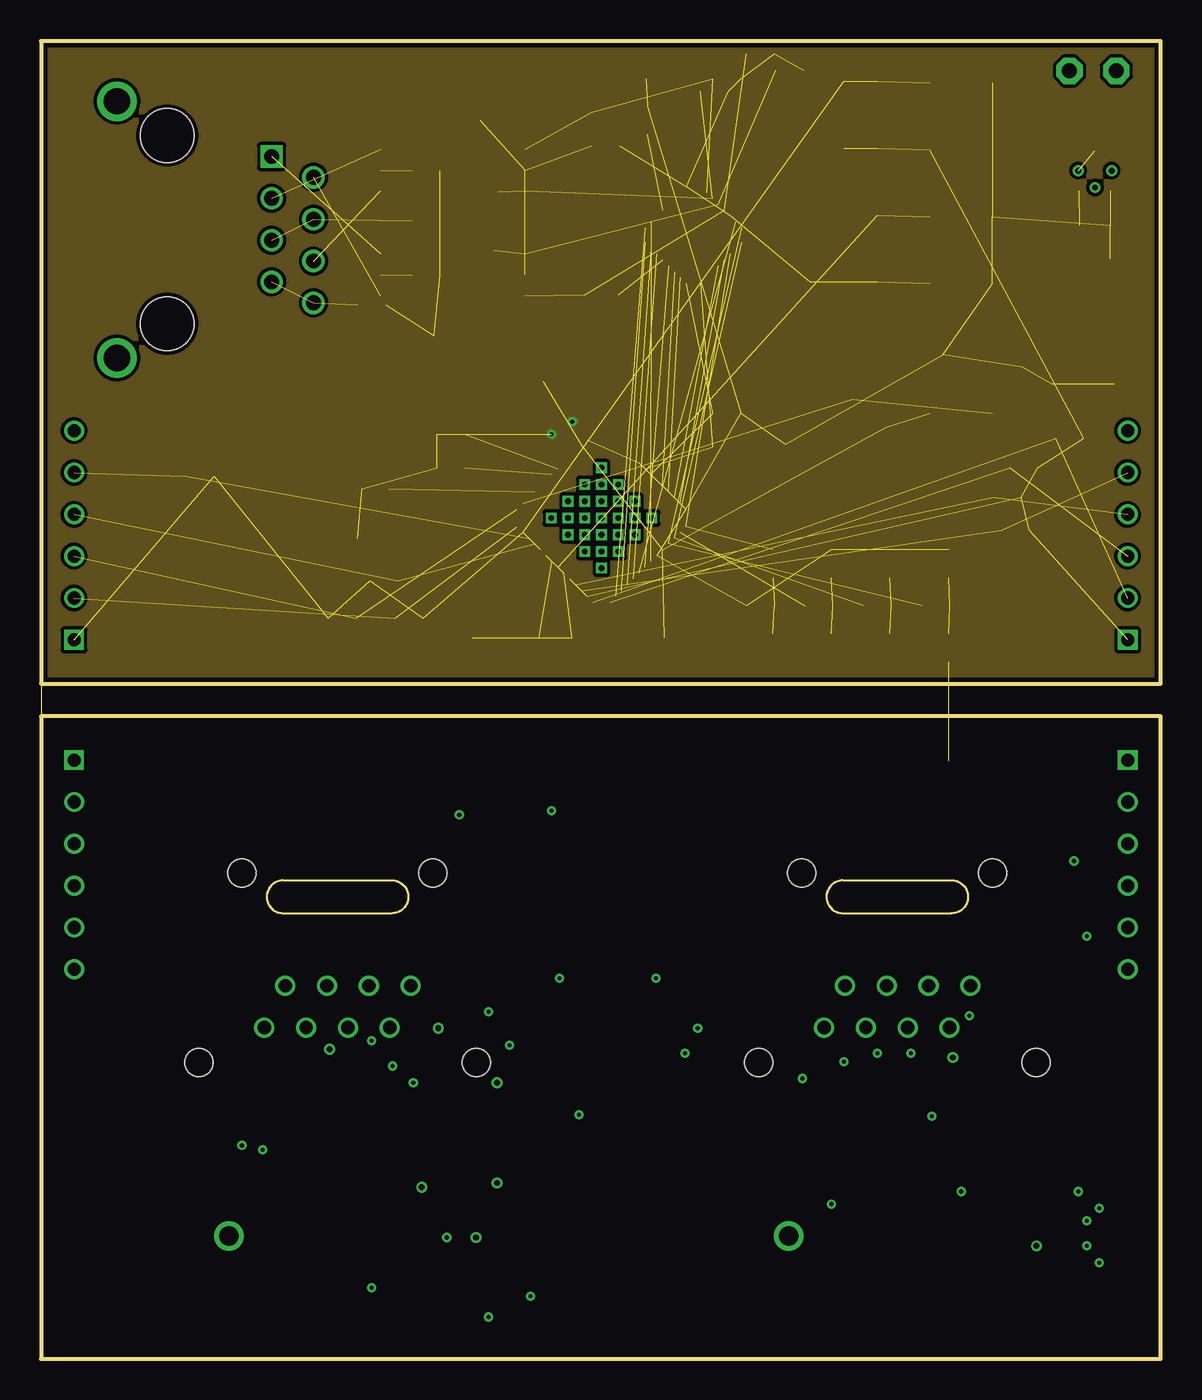
[diagram p8: board, inner layer Route3]
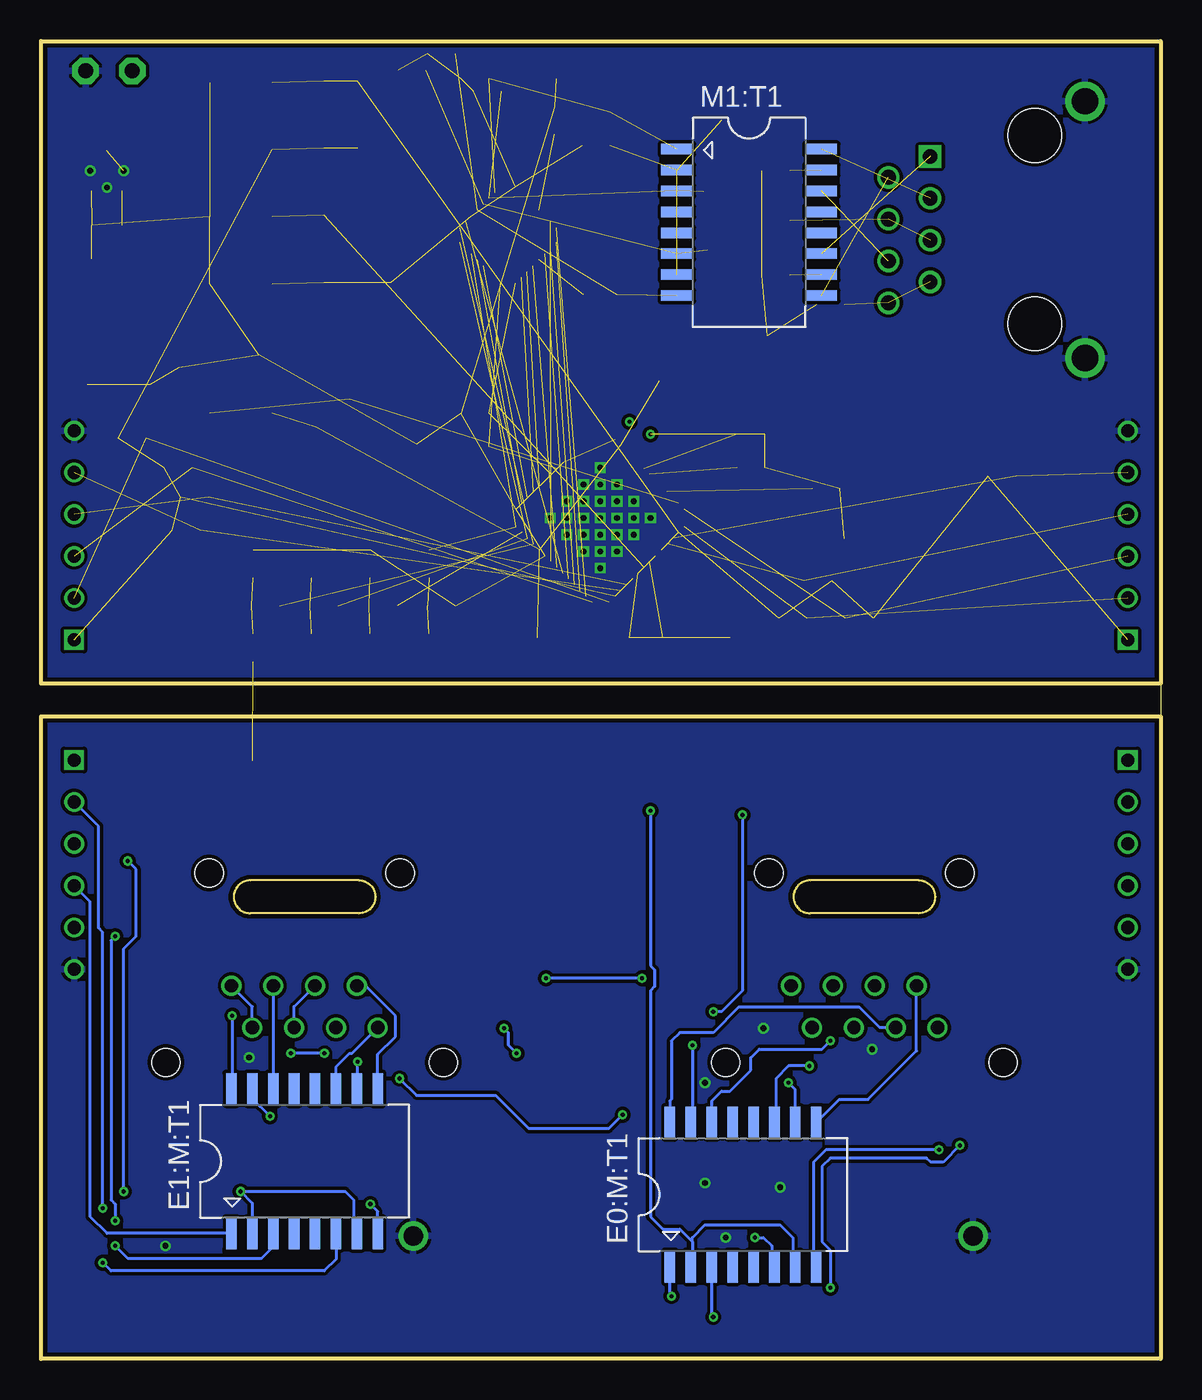
[diagram p9: board, bottom side, seen from below]

Size 68 x 80 mm. Coordinates in mm from the lower left corner, seen from the top.
Outline: 0,41 0,0
Outline: 0,0 68,0 68,39 0,39 0,0
Outline: 0,41 68,41 68,80 0,80 0,41
Copper layers (1+2*3+16): Top 0.018mm / dielectric 0.36mm / Route2 0.035mm / dielectric 0.71mm / Route3 0.035mm / dielectric 0.36mm / Bottom 0.018mm
Design rules "eC_4Layer_PClass5_BaseCopperO18-I35 *": minimum track width 0.175mm, minimum drill 0.25mm, track to track 0.175mm, track to pad 0.175mm, pad to pad 0.175mm, via to via 0.175mm, smd to smd 0mil, copper to edge 0.25mm, drill to drill 0.35mm, minimum pad ring 0.2mm, minimum via ring 0.15mm, stop-mask expansion 0mil, vias tented up to drill 0.45mm, thermal gap 0.2mm

### Footprints (pad centres in the part's own frame; a part is rotated, then mirrored left to right if it is on the bottom)
1,6/0,9 = drill 0.914 pad 1.6 octagon: 1 0,0
C0603 = smd 1.1 x 1: 1 -0.85,0; 2 0.85,0
C1206 = smd 1.6 x 1.8: 1 -1.4,0; 2 1.4,0
SMC_B = smd 1.6 x 2.4: + -1.5,0; - 1.5,0
R0603 = smd 1 x 1.1: 1 -0.85,0; 2 0.85,0
749010012 = smd 0.64 x 1.91: 1 -4.445,-4.385; 2 -3.175,-4.385; 3 -1.905,-4.385; 4 -0.635,-4.385; 5 0.635,-4.385; 6 1.905,-4.385; 7 3.175,-4.385; 8 4.445,-4.385; 9 4.445,4.385; 10 3.175,4.385; 11 1.905,4.385; 12 0.635,4.385; 13 -0.635,4.385; 14 -1.905,4.385; 15 -3.175,4.385; 16 -4.445,4.385
NE8FAV = drill 0.813: 1 -4.445,2.108; 2 -3.175,4.648; 3 -1.905,2.108; 4 -0.635,4.648; 5 0.635,2.108; 6 1.905,4.648; 7 3.175,2.108; 8 4.445,4.648 | drill 1.194: G -6.604,-10.541 | hole 1.7: -8.425,0; 8.425,0; 5.8,11.5; -5.8,11.5
1X06 = drill 0.8 square: 1 -6.35,0 | drill 0.8: 2 -3.81,0; 3 -1.27,0; 4 1.27,0; 5 3.81,0; 6 6.35,0
L4532M = smd 2 x 2.4: 1 -1.9,0; 2 1.9,0
ADSM = smd 0.65 x 0.85: 1 0.825,-0.775; 2 -0.825,-0.775; 3 -0.825,0.775; 4 0.825,0.775
QFN50P800X800X100-57N = smd 0.813 x 0.305: 1 -3.988,3.251; 2 -3.988,2.743; 3 -3.988,2.261; 4 -3.988,1.753; 5 -3.988,1.245; 6 -3.988,0.762; 7 -3.988,0.254; 8 -3.988,-0.254; 9 -3.988,-0.762; 10 -3.988,-1.245; 11 -3.988,-1.753; 12 -3.988,-2.261; 13 -3.988,-2.743; 14 -3.988,-3.251; 29 3.988,-3.251; 30 3.988,-2.743; 31 3.988,-2.261; 32 3.988,-1.753; 33 3.988,-1.245; 34 3.988,-0.762; 35 3.988,-0.254; 36 3.988,0.254; 37 3.988,0.762; 38 3.988,1.245; 39 3.988,1.753; 40 3.988,2.261; 41 3.988,2.743; 42 3.988,3.251 | smd 0.305 x 0.813: 15 -3.251,-3.988; 16 -2.743,-3.988; 17 -2.261,-3.988; 18 -1.753,-3.988; 19 -1.245,-3.988; 20 -0.762,-3.988; 21 -0.254,-3.988; 22 0.254,-3.988; 23 0.762,-3.988; 24 1.245,-3.988; 25 1.753,-3.988; 26 2.261,-3.988; 27 2.743,-3.988; 28 3.251,-3.988; 43 3.251,3.988; 44 2.743,3.988; 45 2.261,3.988; 46 1.753,3.988; 47 1.245,3.988; 48 0.762,3.988; 49 0.254,3.988; 50 -0.254,3.988; 51 -0.762,3.988; 52 -1.245,3.988; 53 -1.753,3.988; 54 -2.261,3.988; 55 -2.743,3.988; 56 -3.251,3.988 | smd 5.994 x 5.994: 57 0,0
QFN50P500X500X100-33N = smd 0.813 x 0.305: 1 -2.388,1.753; 2 -2.388,1.245; 3 -2.388,0.762; 4 -2.388,0.254; 5 -2.388,-0.254; 6 -2.388,-0.762; 7 -2.388,-1.245; 8 -2.388,-1.753; 17 2.388,-1.753; 18 2.388,-1.245; 19 2.388,-0.762; 20 2.388,-0.254; 21 2.388,0.254; 22 2.388,0.762; 23 2.388,1.245; 24 2.388,1.753 | smd 0.305 x 0.813: 9 -1.753,-2.388; 10 -1.245,-2.388; 11 -0.762,-2.388; 12 -0.254,-2.388; 13 0.254,-2.388; 14 0.762,-2.388; 15 1.245,-2.388; 16 1.753,-2.388; 25 1.753,2.388; 26 1.245,2.388; 27 0.762,2.388; 28 0.254,2.388; 29 -0.254,2.388; 30 -0.762,2.388; 31 -1.245,2.388; 32 -1.753,2.388 | smd 3.454 x 3.454: 33 0,0
SOT95P284X122-5N = smd 1.27 x 0.533: 1 -1.219,0.94; 2 -1.219,0; 3 -1.219,-0.94; 4 1.219,-0.94; 5 1.219,0.94
MOLEX_85505-5113 = drill 0.9 square: 1 0,0 | drill 0.9: 2 1.27,2.54; 3 2.54,0; 4 3.81,2.54; 5 5.08,0; 6 6.35,2.54; 7 7.62,0; 8 8.89,2.54 | drill 1.6: M1 -3.35,-9.4; M2 12.24,-9.4 | hole 3.25: -1.27,-6.35; 10.16,-6.35

### Placement (x,y rotation side)
+5V-1  62.46,78.19 270 top
C4  45.21,56.39 90 top
C5  66.04,59.18 0 top
C6  62.23,59.18 0 top
C7  37.59,77.72 0 top
C8  55.63,60.96 0 top
C9  50.8,76.71 270 top
C10  48.77,76.71 270 top
C11  50.8,72.64 270 top
C12  48.77,72.64 270 top
C13  49.28,57.4 270 top
C14  50.8,68.58 270 top
C15  51.31,57.4 90 top
C16  30.48,60.2 90 top
C17  37.85,42.93 270 top
C18  28.19,42.93 270 top
C19  32.26,42.93 270 top
C20  26.16,42.93 270 top
C21  60.45,60.2 0 top
C23  65.53,75.69 0 top
C24  62.23,68.83 180 top
C25  65.79,68.83 0 top
C26  65.79,66.8 0 top
C27  50.8,64.52 270 top
C28  48.77,64.52 270 top
C29  46.74,64.52 270 top
C30  35.05,63.75 270 top
C31  20.07,49.78 0 top
E0:M:C1  1000pF, 2kV  [C1206]  35.05,29.97 90 top
E0:M:C2  .022uF  [SMC_B]  16.51,36.32 0 top
E0:M:C3  15pF, 50V  [C0603]  4.57,27.94 270 top
E0:M:C4  15pF, 50V  [C0603]  6.86,25.4 270 top
E0:M:C5  15pF, 50V  [C0603]  4.57,33.02 270 top
E0:M:C6  15pF, 50V  [C0603]  6.86,30.48 270 top
E0:M:R1  75  [R0603]  33.53,26.42 180 top
E0:M:R2  75  [R0603]  33.53,24.38 0 top
E0:M:R3  75  [R0603]  36.58,24.38 0 top
E0:M:R4  75  [R0603]  36.58,26.42 180 top
E0:M:R5  10, 1/8W, 1%  [R0603]  11.94,36.32 180 top
E0:M:T1  [749010012]  25.37,9.97 0 bottom
E0:X0  NE8FAV  [NE8FAV]  18,18 0 top
E1:M:C1  1000pF, 2kV  [C1206]  35.05,12.7 270 top
E1:M:C2  .022uF  [SMC_B]  56.64,36.32 180 top
E1:M:C3  15pF, 50V  [C0603]  63.5,27.69 270 top
E1:M:C4  15pF, 50V  [C0603]  61.21,25.4 270 top
E1:M:C5  15pF, 50V  [C0603]  63.5,33.02 270 top
E1:M:C6  15pF, 50V  [C0603]  61.21,30.23 270 top
E1:M:R1  75  [R0603]  33.53,16.26 180 top
E1:M:R2  75  [R0603]  33.53,18.29 0 top
E1:M:R3  75  [R0603]  36.58,18.29 0 top
E1:M:R4  75  [R0603]  36.58,16.26 180 top
E1:M:R5  10, 1/8W, 1%  [R0603]  60.96,36.32 0 top
E1:M:T1  [749010012]  52,12 0 bottom
E1:X0  NE8FAV  [NE8FAV]  52,18 0 top
F0:R6  49.9, 1/8W, 1%  [R0603]  22.35,44.96 0 top
F0:R7  49.9, 1/8W, 1%  [R0603]  18.29,44.96 180 top
F0:R8  49.9, 1/8W, 1%  [R0603]  20.83,47.24 180 top
F0:R9  49.9, 1/8W, 1%  [R0603]  9.65,53.59 0 top
F1:R6  49.9, 1/8W, 1%  [R0603]  62.48,55.88 0 top
F1:R7  49.9, 1/8W, 1%  [R0603]  59.69,54.1 0 top
F1:R8  49.9, 1/8W, 1%  [R0603]  58.67,52.32 0 top
F1:R9  49.9, 1/8W, 1%  [R0603]  59.18,50.29 0 top
F2:R6  49.9, 1/8W, 1%  [R0603]  45.47,78.23 0 top
F2:R7  49.9, 1/8W, 1%  [R0603]  43.69,79.25 0 top
F2:R8  49.9, 1/8W, 1%  [R0603]  41.66,77.72 0 top
F2:R9  49.9, 1/8W, 1%  [R0603]  40.89,76.96 0 top
GND-1  65.3,78.19 270 top
JC1  2,50 90 top
JC2  66,50 90 top
JP1  2,30 270 top
JP2  66,30 270 top
L1  55.88,77.47 180 top
L2  55.88,73.41 180 top
L3  55.88,57.4 0 top
L4  55.88,69.34 180 top
L5  55.88,65.28 180 top
M1:C1  1000pF, 2kV  [C1206]  23.88,60.71 270 top
M1:C2  .022uF  [SMC_B]  26.67,76.71 90 top
M1:C3  15pF, 50V  [C0603]  34.29,75.69 0 top
M1:C4  15pF, 50V  [C0603]  26.92,70.87 180 top
M1:C5  15pF, 50V  [C0603]  26.67,67.31 180 top
M1:C6  15pF, 50V  [C0603]  33.02,63.75 270 top
M1:R1  75  [R0603]  23.37,69.09 180 top
M1:R2  75  [R0603]  23.37,65.79 0 top
M1:R3  75  [R0603]  20.07,64.01 180 top
M1:R4  75  [R0603]  23.37,72.14 0 top
M1:R5  10, 1/8W, 1%  [R0603]  34.29,73.66 0 top
M1:T1  [749010012]  25,69 270 bottom
O1  20.32,53.59 180 top
O2  37.59,75.18 90 top
R10  43.69,45.72 0 top
R11  44.45,48.26 90 top
R12  48.01,48.26 270 top
R13  47.24,45.72 180 top
R14  51.56,48.26 270 top
R15  50.8,45.72 180 top
R16  55.12,48.26 270 top
R17  54.36,45.72 180 top
R18  24.89,54.1 180 top
R19  24.89,56.13 180 top
R20  41.66,57.4 0 top
R21  41.66,55.37 180 top
R22  30.23,42.93 90 top
SJ2  44.45,43.18 270 top
SJ3  48.01,43.18 270 top
SJ4  51.56,43.18 270 top
SJ5  55.12,43.18 270 top
U1  34.04,51.05 135 top
U2  39.63,68.24 315 top
U3  64.01,72.14 270 top
X10  14,73 270 top

### Tracks (layer width: path | path; a pad name or v marks a point on that pad's centre or on a via)
+3V3  (via drill 0.25)  (26 unrouted)
  Top 0.203: U1.30 32.26,56.71 v32.26,56.9
  other vias: 30.99,56.13
  pour Route3 (rank 6): -1.02,-1.27 69.34,-1.27 69.34,80.77 -1.02,80.77
  pour Top: 32.13,54.23 32.89,54.99 30.99,56.9 30.23,56.13
+5V
  pour Top: 65.79,72.64 62.23,72.64 62.23,75.18 60.96,76.45 60.96,80.01 64.01,80.01 64.01,76.71 65.79,76.71
AVDD  (10 unrouted)
DUPLEX_POL_0  (2 unrouted)
E0:M:N$1  (via drill 0.25)
  Top 0.175: E0:M:R5.1 E0:M:C2.+ 15.24,36.32 17.27,34.29 29.97,34.29 v30.99,33.27
  Bottom 0.175: v30.99,33.27 30.99,23.88 30.73,23.62 30.73,22.61 30.99,22.35 30.99,8.64 30.23,7.87 29.21,7.87 28.45,7.11 | 28.45,7.11 28.45,5.68 E0:M:T1.2 | 28.45,7.11 28.45,7.37 27.69,8.13 23.11,8.13 22.35,7.37 22.35,5.74 E0:M:T1.7
E0:M:N$2  (via drill 0.25)
  Top 0.175: v22.61,16.76 22.61,21.08 23.62,22.1 32,22.1 32.51,22.61 32.51,24.22 E0:M:R2.1
  Bottom 0.175: E0:M:T1.10 22.19,16.35 v22.61,16.76
E0:M:N$3  (via drill 0.25)
  Top 0.175: E0:M:R4.1 37.43,26.25 36.58,25.4 36.58,22.1 36.07,21.59 29.21,21.59 28.7,21.08 28.7,19.3 v28.45,19.05
  Bottom 0.175: v28.45,19.05 28.45,14.45 E0:M:T1.15
E0:M:N$8
  Top 0.175: E0:M:R1.1 E0:M:R4.2 | E0:M:R4.2 E0:M:R3.1 E0:M:R2.2 | E0:M:C1.1 35.05,27.69 35.56,27.18 35.56,26.58 E0:M:R4.2
E0:N$1  (via drill 0.25)
  Top 0.175: E0:X0.1 15.88,17.78 v21.34,17.78
  Bottom 0.175: v21.34,17.78 22.61,17.78 23.37,17.02 23.37,14.45 E0:M:T1.11
E0:N$2
  Bottom 0.175: E0:M:T1.9 19.53,15.75 17.78,15.75 14.82,18.7 E0:X0.2
E0:N$3
  Bottom 0.175: E0:X0.3 17.06,20.11 18.29,21.34 25.65,21.34 27.18,19.81 29.21,19.81 29.72,19.3 29.72,15.75 29.81,15.65 E0:M:T1.16
E0:N$4  (via drill 0.25)
  Top 0.175: v20.07,19.3 20.07,22.49 E0:X0.6
  Bottom 0.175: E0:M:T1.14 27.27,15.65 26.67,16.26 26.16,16.26 24.89,17.53 24.89,18.29 24.38,18.8 20.57,18.8 v20.07,19.3
E0:N$5
  Top 0.175: E0:X0.5 18.64,21.38 | 18.64,21.38 E0:X0.4 | 18.64,21.38 18.64,22.95 19.3,23.62 30.73,23.62 31.5,24.38 31.5,25.23 E0:M:R1.2
E0:N$6  (via drill 0.25)
  Top 0.175: E0:X0.7 21.18,21.38 E0:X0.8 31.03,22.65 v31.5,23.11 | v37.34,23.11 37.34,24.3 E0:M:R3.2
  Bottom 0.175: v31.5,23.11 v37.34,23.11
E1:M:N$1  (via drill 0.25)
  Top 0.175: E1:M:R5.1 E1:M:C2.+ 59.69,34.77 59.69,19.56 58.93,18.8 58.93,11.18 57.91,10.16 v55.88,10.16
  Bottom 0.175: E1:M:T1.7 49.02,7.81 49.02,9.65 49.53,10.16 v55.88,10.16 55.17,9.46 E1:M:T1.2
E1:M:N$2  (via drill 0.25)
  Top 0.175: v48.77,18.03 48.26,18.54 45.21,18.54 44.45,19.3 33.78,19.3 32.77,18.29 E1:M:R2.1
  Bottom 0.175: E1:M:T1.10 48.77,16.44 v48.77,18.03
E1:M:N$3  (via drill 0.25)
  Top 0.175: E1:M:R4.1 38.95,14.73 v54.1,14.73
  Bottom 0.175: v54.1,14.73 55.17,15.8 E1:M:T1.15
E1:M:N$8
  Top 0.175: E1:M:R4.2 35.73,14.77 E1:M:C1.1 34.38,14.77 E1:M:R1.1 E1:M:R2.2 | E1:M:R4.2 34.54,16.26 | E1:M:R4.2 E1:M:R3.1
E1:N$1
  Bottom 0.175: E1:M:T1.11 50.09,17.72 49.28,18.54 49.12,18.54 E1:X0.1
E1:N$2
  Bottom 0.175: E1:M:T1.9 47.55,18.48 46.48,19.56 46.48,20.83 48.3,22.65 E1:X0.2
E1:N$3  (via drill 0.25)
  Top 0.175: E1:X0.3 51.32,21.34 55.88,21.34 v56.39,20.83
  Bottom 0.175: v56.39,20.83 56.39,16.44 E1:M:T1.16
E1:N$4
  Bottom 0.175: E1:X0.6 E1:M:T1.14
E1:N$5  (via drill 0.25)
  Top 0.175: E1:M:R1.2 v32.68,14.82 | E1:X0.5 52.58,20.07 51.62,19.11 51.62,17.84 50.8,17.02 v46.23,17.02
  Bottom 0.175: v32.68,14.82 33.53,13.97 38.35,13.97 40.39,16 45.21,16 v46.23,17.02 | E1:X0.5 52.63,21.38 E1:X0.4
E1:N$6  (via drill 0.25)
  Top 0.175: E1:M:R3.2 37.68,18.54 v39.12,18.54 | v39.88,20.07 44.45,20.07 45.47,19.05 50.29,19.05 v50.8,18.54 | v52.83,18.54 53.61,18.54 E1:X0.7
  Bottom 0.175: E1:X0.7 55.17,21.38 E1:X0.8 | v39.12,18.54 39.62,19.05 39.62,19.81 v39.88,20.07 | v50.8,18.54 v52.83,18.54
E2_1  (1 unrouted)
E2_2  (1 unrouted)
E2_3  (1 unrouted)
E2_4/5  (2 unrouted)
E2_6  (1 unrouted)
E2_7/8  (2 unrouted)
EE_SCL/SCL  (1 unrouted)
EE_SDA/SDA  (1 unrouted)
GND  (via drill 0.35)  (2 unrouted)
  Top 0.203: v33.02,53.09 31.75,54.35 U1.34
  other vias: 62.99,72.14 65.02,72.14 64.01,71.12 34.04,48.01 34.04,49.02 33.02,49.02 35.05,49.02 33.02,50.04 32,50.04 32,51.05 30.99,51.05 32,52.07 33.02,51.05 33.02,52.07 34.04,50.04 34.04,51.05 34.04,52.07 35.05,50.04 35.05,51.05 35.05,52.07 36.07,51.05 36.07,52.07 36.07,50.04 37.08,51.05 35.05,53.09 34.04,53.09 34.04,54.1 23.11,10.41 27.69,10.67 17.53,18.8 24.13,20.07 27.69,16.76 55.37,18.29 60.45,6.86 26.42,7.37
  pour Bottom (rank 6): -3.05,-3.3 71.37,-3.3 71.37,82.8 -3.05,82.8
  pour Route2 (rank 6): -2.03,-2.29 70.36,-2.29 70.36,81.79 -2.03,81.79
  pour Top (rank 6): -3.05,-3.3 71.37,-3.3 71.37,82.8 -3.05,82.8
M1:N$1  (3 unrouted)
M1:N$2  (1 unrouted)
M1:N$3  (1 unrouted)
M1:N$8  (4 unrouted)
MDC  (2 unrouted)
MDIO  (2 unrouted)
N$19  (1 unrouted)
N$21  (1 unrouted)
N$22  (via drill 0.25)
  Top 0.175: JP1.2 4.51,33.81 E0:M:C5.1 24.55,33.87 v25.4,33.02 | v27.18,21.08 27.18,20.07 26.42,20.07 25.15,18.8 25.15,7.87 v24.64,7.37
  Bottom 0.175: v25.4,33.02 25.4,22.35 26.67,21.08 v27.18,21.08 | v24.64,7.37 24.13,7.37 23.62,6.86 23.62,5.74 E0:M:T1.6
N$23  (via drill 0.25)
  Top 0.175: JP1.3 6.8,31.27 E0:M:C6.1 9.82,31.33 10.67,30.48 10.67,25.4 12.45,23.62 12.45,13.72 v13.46,12.7
  Bottom 0.175: v13.46,12.7 20.32,12.7 21.08,11.94 21.08,5.74 E0:M:T1.8
N$24  (via drill 0.25)
  Top 0.175: JP1.4 4.51,28.73 E0:M:C3.1 5.5,28.79 5.59,28.7 7.87,28.7 7.96,28.79 9.56,28.79 10.16,28.19 10.16,25.15 11.94,23.37 11.94,13.21 v12.19,12.95 | v20.07,4.32 20.57,3.81 v29.72,3.81
  Bottom 0.175: v12.19,12.95 13.21,11.94 13.97,11.94 14.22,12.19 20.07,12.19 20.57,11.68 20.57,7.11 20.07,6.6 v20.07,4.32 | v29.72,3.81 29.81,3.9 E0:M:T1.1
N$25  (via drill 0.25)
  Top 0.175: JP1.5 6.86,26.19 | 6.86,26.19 E0:M:C4.1 | 6.86,26.19 8.35,26.19 11.43,23.11 11.43,12.7 12.95,11.18 12.95,3.56 13.97,2.54 v27.18,2.54
  Bottom 0.175: v27.18,2.54 27.27,2.63 E0:M:T1.3
N$29
  Top 0.203: E1:M:R5.2 65.97,36.32 JP2.1
N$38
  Top 0.203: JP1.1 11.06,36.35 E0:M:R5.2
N$300  (via drill 0.25)
  Top 0.175: v64.26,5.84 v64.26,9.14 | E1:M:C5.1 65.94,33.87 JP2.2
  Bottom 0.175: E1:M:T1.6 50.09,6.04 50.8,5.33 63.75,5.33 v64.26,5.84 | v64.26,9.14 64.26,25.91 64.52,26.16 64.52,32.33 JP2.2
N$301  (via drill 0.25)
  Top 0.175: E1:M:C6.1 63.59,31.08 | 63.59,31.08 65.81,31.08 JP2.3 | v48.01,9.4 62.23,9.4 v62.99,10.16 | v62.74,30.23 63.59,31.08
  Bottom 0.175: E1:M:T1.8 47.55,8.95 v48.01,9.4 | v62.99,10.16 62.99,24.89 62.23,25.65 62.23,29.72 v62.74,30.23
N$302
  Top 0.175: E1:M:C3.1 65.81,28.54 JP2.4
  Bottom 0.175: E1:M:T1.1 64,7.62 65.02,8.64 65.02,27.75 JP2.4
N$303  (via drill 0.25)
  Top 0.175: JP2.5 65.46,25.65 v63.5,25.65 62.74,25.65 62.14,26.25 E1:M:C4.1 | v63.5,8.38 v63.5,6.86
  Bottom 0.175: v63.5,25.65 63.75,25.4 63.75,9.65 63.5,9.4 v63.5,8.38 | v63.5,6.86 62.74,6.1 54.61,6.1 53.91,6.8 E1:M:T1.3
P0_COL  (1 unrouted)
P0_CRS  (1 unrouted)
P0_INCLK  (1 unrouted)
P0_IND0  (1 unrouted)
P0_IND1  (1 unrouted)
P0_IND2  (1 unrouted)
P0_IND3  (1 unrouted)
P0_INDV  (1 unrouted)
P0_INER  (1 unrouted)
P0_MODE0  (2 unrouted)
P0_MODE2  (2 unrouted)
P0_OUTCLK  (1 unrouted)
P0_OUTD0/P0_MODE0  (2 unrouted)
P0_OUTD1/P0_MODE1  (1 unrouted)
P0_OUTD2/P0_MODE2  (2 unrouted)
P0_OUTD3/DUPLEX_POL_0  (2 unrouted)
P0_OUTDV  (1 unrouted)
PO_MODE1  (2 unrouted)
RXN0  (3 unrouted)
RXN1  (2 unrouted)
RXN2  (2 unrouted)
RXP0  (3 unrouted)
RXP1  (2 unrouted)
RXP2  (2 unrouted)
TXN0  (3 unrouted)
TXN1  (2 unrouted)
TXN2  (2 unrouted)
TXP0  (3 unrouted)
TXP1  (2 unrouted)
TXP2  (2 unrouted)
VDD18CORE  (5 unrouted)
VDD18PLL  (2 unrouted)
VDD18TX  (4 unrouted)
VDD33A1  (9 unrouted)
VDD33A2  (9 unrouted)
VDD33BIAS  (2 unrouted)
VDDIO  (1 unrouted)
XI  (1 unrouted)
XTAL1/CLKIN  (1 unrouted)